# Altium project APP_1_huom2704.PrjPcb (part 2 of 3)

## Sheet APP_1_Connectors_m.SchDoc
size Tabloid; SheetNumber: 4; SheetTotal: 16; Sheet_Name: Connectors_m; Size: 11x17
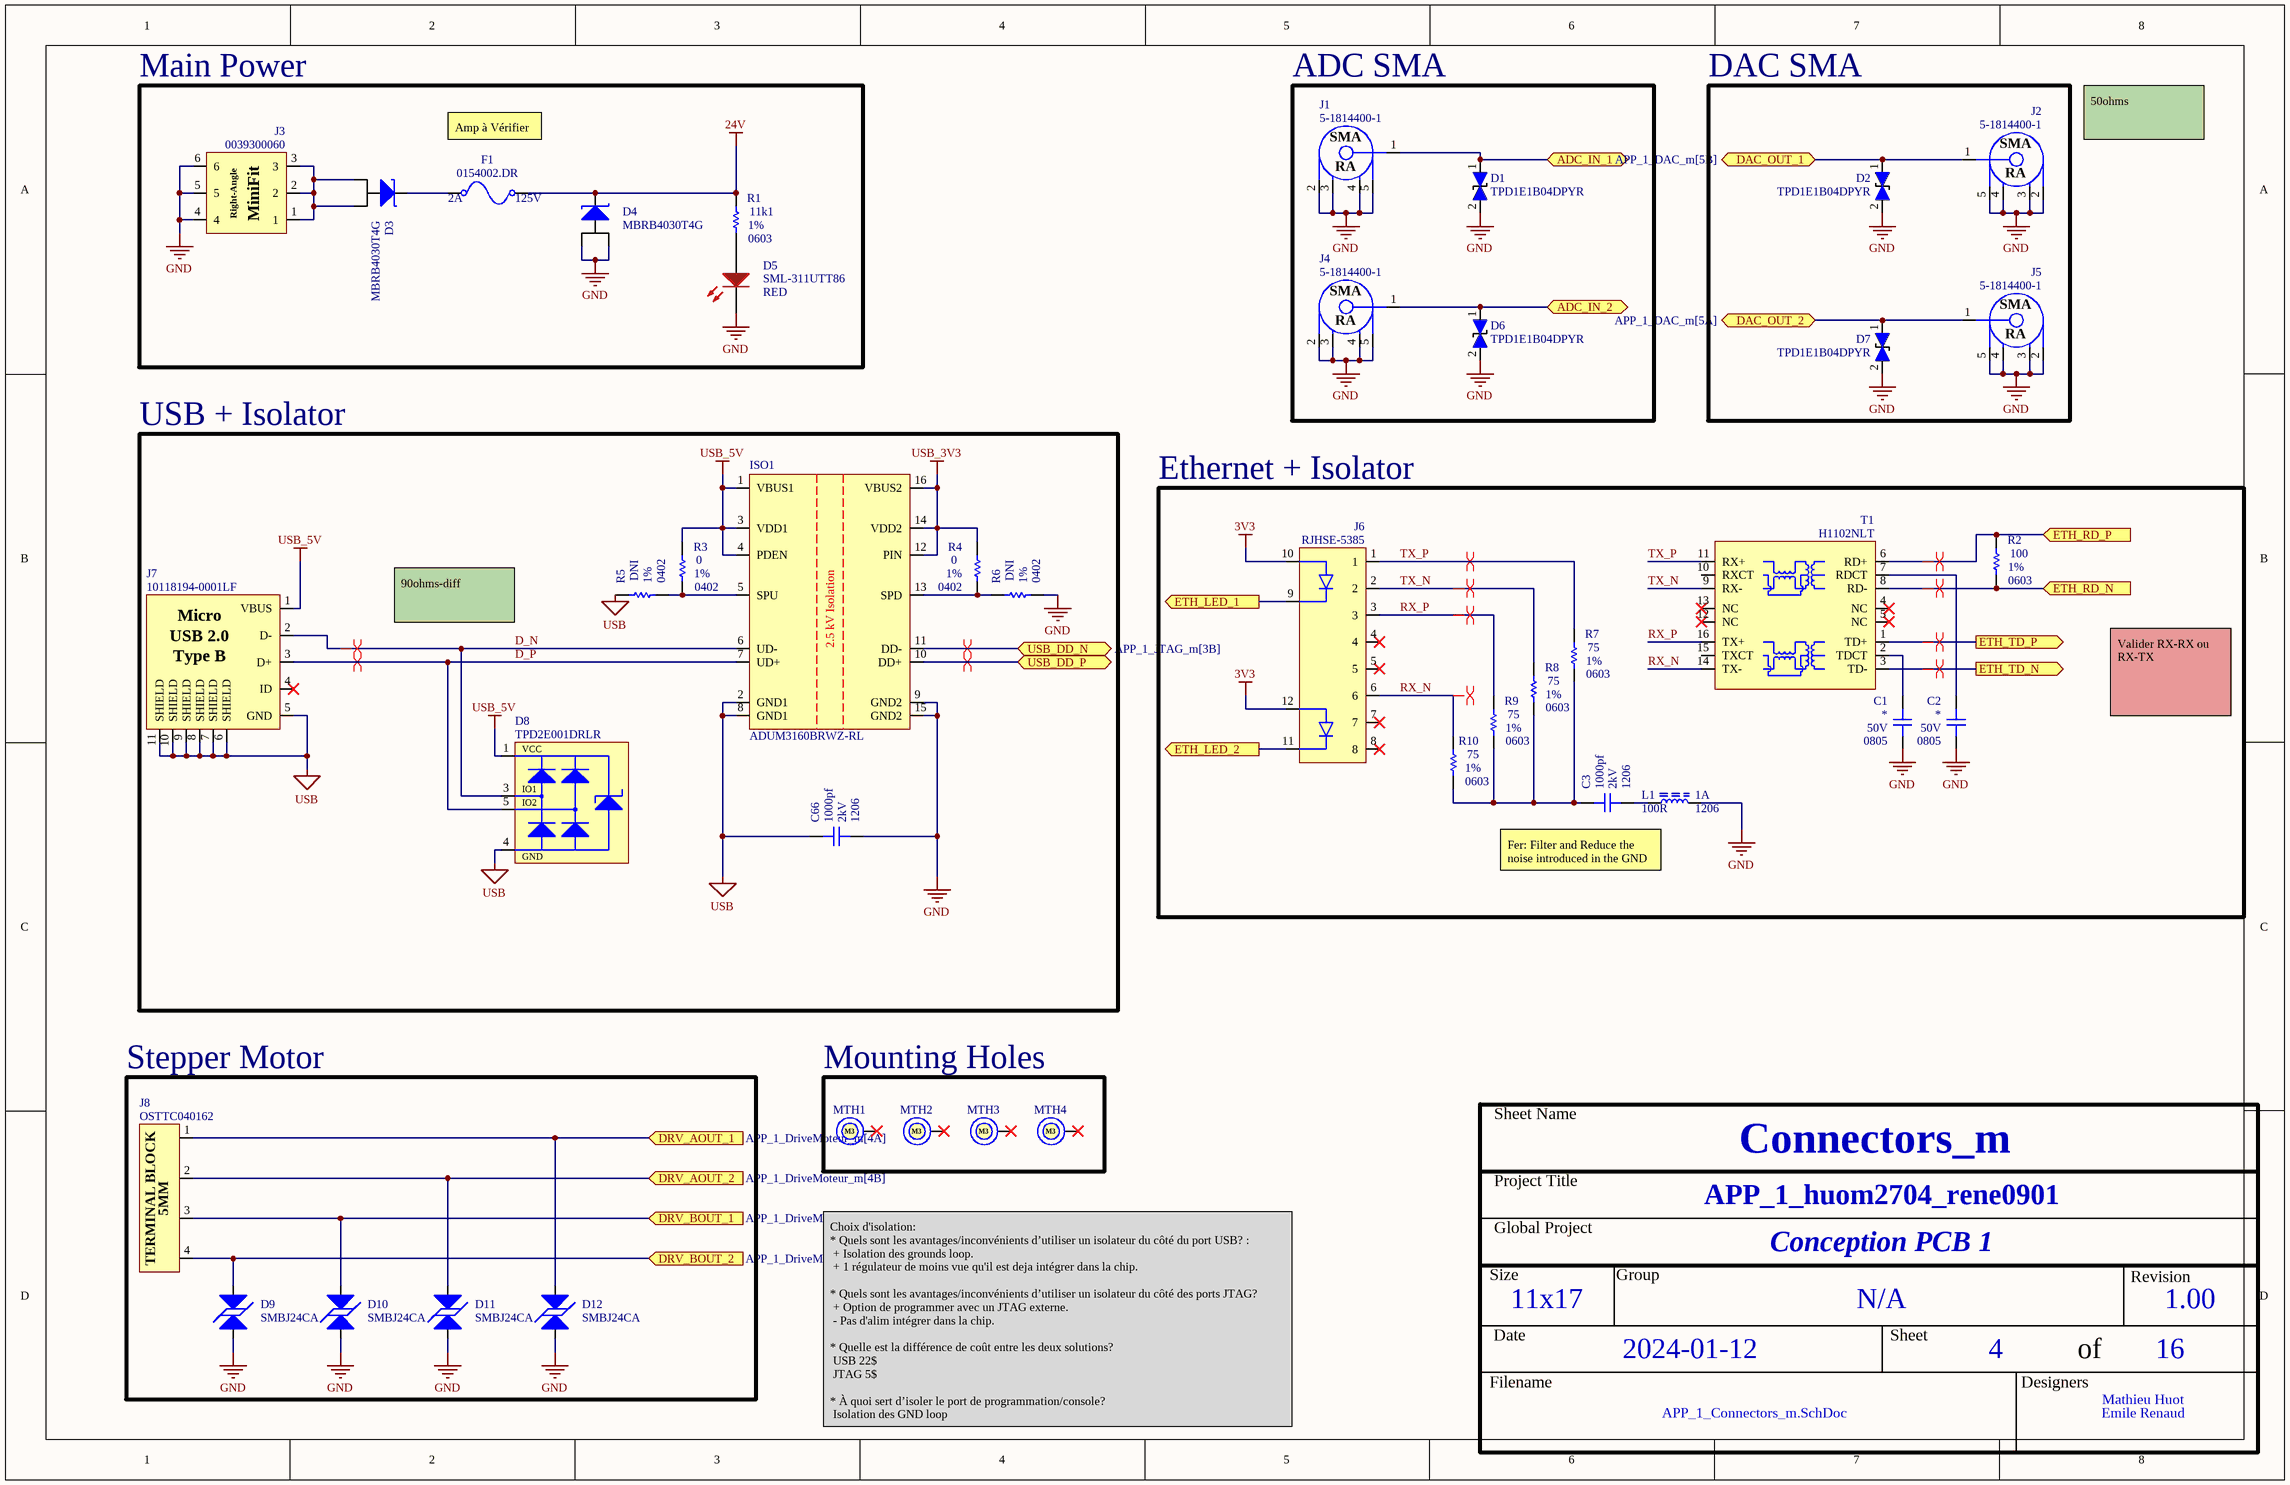
[diagram p6: APP_1_Connectors_m.SchDoc]

### Parts
(Parts that share a designator on the sheet are numbered #1, #2 ... from top to bottom, then left to right.)
C1  Voltage: 50V  Package: 0805  [CAP_0805]  (hidden comment: CAP - 0805)
C2  Voltage: 50V  Package: 0805  [CAP_0805]  (hidden comment: CAP - 0805)
C3  value 1000pf  Voltage: 2kV  Package: 1206  [CAP_1206]  (hidden comment: CAP - 1206)
C66#2  value 1000pf  Voltage: 2kV  Package: 1206  [CAP_1206]  (hidden comment: CAP - 1206)
D1  TPD1E1B04DPYR  [TVS_DATA_TPD1E1B04DPYR]
D2  TPD1E1B04DPYR  [TVS_DATA_TPD1E1B04DPYR]
D3  MBRB4030T4G  [DIO_SCHOTTKY_MBRB4030T4G]
D4  MBRB4030T4G  [DIO_SCHOTTKY_MBRB4030T4G]
D5  SML-311UTT86  value RED  [LED_0603]
D6  TPD1E1B04DPYR  [TVS_DATA_TPD1E1B04DPYR]
D7  TPD1E1B04DPYR  [TVS_DATA_TPD1E1B04DPYR]
D8  TPD2E001DRLR  [TVS_USB_TPD2E001DRLR]
D9  SMBJ24CA  [TVS_PWR_SMBJ36CA]
D10  SMBJ24CA  [TVS_PWR_SMBJ36CA]
D11  SMBJ24CA  [TVS_PWR_SMBJ36CA]
D12  SMBJ24CA  [TVS_PWR_SMBJ36CA]
F1  0154002.DR  Voltage Rating: 125V  Current Rating: 2A  [FUS_0154XXX.DR]
ISO1  ADUM3160BRWZ-RL  [ISO_ADUM3160BRWZ-RL]
J1  5-1814400-1  [CONN_SMA_5-1814400-1]
J2  5-1814400-1  [CONN_SMA_5-1814400-1]
J3  0039300060  [CON_MINIFIT_0039300060]
J4  5-1814400-1  [CONN_SMA_5-1814400-1]
J5  5-1814400-1  [CONN_SMA_5-1814400-1]
J6  RJHSE-5385  [CONN_ETHERNET_RJHSE-5385]
J7  10118194-0001LF  [CON_USB_10118194-0001LF]
J8  OSTTC040162  [CONN_TERMINAL_OSTTA040161]
L1  value 100R  Current: 1A  Package: 1206  [FER_1206]  (hidden comment: FER - 1206)
MTH1  M3  [MTH_M3]  (no BOM)
MTH2  M3  [MTH_M3]  (no BOM)
MTH3  M3  [MTH_M3]  (no BOM)
MTH4  M3  [MTH_M3]  (no BOM)
R1  value 11k1  Package: 0603  Precision: 1%  [RES_0603]  (hidden comment: RES - 0603)
R2  value 100  Package: 0603  Precision: 1%  [RES_0603]  (hidden comment: RES - 0603)
R3  value 0  Package: 0402  Precision: 1%  [RES_0402]  (hidden comment: RES - 0402)
R4  value 0  Package: 0402  Precision: 1%  [RES_0402]  (hidden comment: RES - 0402)
R5  value DNI  Package: 0402  Precision: 1%  [RES_0402]  (hidden comment: RES - 0402)
R6  value DNI  Package: 0402  Precision: 1%  [RES_0402]  (hidden comment: RES - 0402)
R7  value 75  Package: 0603  Precision: 1%  [RES_0603]  (hidden comment: RES - 0603)
R8  value 75  Package: 0603  Precision: 1%  [RES_0603]  (hidden comment: RES - 0603)
R9  value 75  Package: 0603  Precision: 1%  [RES_0603]  (hidden comment: RES - 0603)
R10  value 75  Package: 0603  Precision: 1%  [RES_0603]  (hidden comment: RES - 0603)
T1  H1102NLT  [TRANSFO_H1102NLT]

### Blocks framed on the sheet
Main Power: D3-D5 F1 J3 R1
ADC SMA: D1 D6 J1 J4
DAC SMA: D2 D7 J2 J5
USB + Isolator: C66#2 D8 ISO1 J7 R3-R6
Ethernet + Isolator: C1-C3 J6 L1 R2 R7-R10 T1
Stepper Motor: D9-D12 J8
Mounting Holes: MTH1-MTH4

### Ports
ADC_IN_1 (bidir, see APP_1_ADC_m[1B]), ADC_IN_2 (bidir, see APP_1_ADC_m[1A]), DAC_OUT_1 (bidir, see APP_1_DAC_m[5B]), DAC_OUT_2 (bidir, see APP_1_DAC_m[5A]), DRV_AOUT_1 (in, see APP_1_DriveMoteur_m[4A]), DRV_AOUT_2 (in, see APP_1_DriveMoteur_m[4B]), DRV_BOUT_1 (in, see APP_1_DriveMoteur_m[4B]), DRV_BOUT_2 (in, see APP_1_DriveMoteur_m[4C]), ETH_LED_1 (out), ETH_LED_2 (out), ETH_RD_N (in, see APP_1_Ethernet_m[3B]), ETH_RD_P (in, see APP_1_Ethernet_m[3B]), ETH_TD_N (out, see APP_1_Ethernet_m[3B]), ETH_TD_P (out, see APP_1_Ethernet_m[3B]), USB_DD_N (bidir, see APP_1_JTAG_m[3B]), USB_DD_P (bidir, see APP_1_JTAG_m[3B])

### Nets
3V3: J6.10(LED1_A) J6.12(LED2_A)
24V: D4.4 F1.2 R1.2
GND: C1.1 C2.1 C66#2.1 D1.2(i/o) D2.2(i/o) D4.1(A) D4.3 D5.K D6.2(i/o) D7.2(i/o) D9.2 D10.2 D11.2 D12.2 ISO1.9(GND2) ISO1.15(GND2) J1.2 J1.3 J1.4 J1.5 J2.2 J2.3 J2.4 J2.5 J3.4 J3.5 J3.6 J4.2 J4.3 J4.4 J4.5 J5.2 J5.3 J5.4 J5.5 L1.1 R6.1
USB: C66#2.2 D8.4(GND) ISO1.2(GND1) ISO1.8(GND1) J7.5(GND) J7.6(SHIELD) J7.7(SHIELD) J7.8(SHIELD) J7.9(SHIELD) J7.10(SHIELD) J7.11(SHIELD) R5.2
USB_3V3: ISO1.12(PIN) ISO1.14(VDD2) ISO1.16(VBUS2) R4.2
USB_5V: D8.1(VCC) ISO1.1(VBUS1) ISO1.3(VDD1) ISO1.4(PDEN) J7.1(VBUS) R3.2
ADC_IN_1: D1.1(i/o) J1.1 ; port ADC_IN_1
ADC_IN_2: D6.1(i/o) J4.1 ; port ADC_IN_2
D_N: D8.3(IO1) ISO1.6(UD-) J7.2(D-)
D_P: D8.5(IO2) ISO1.7(UD+) J7.3(D+)
DAC_OUT_1: D2.1(i/o) J2.1 ; port DAC_OUT_1
DAC_OUT_2: D7.1(i/o) J5.1 ; port DAC_OUT_2
DRV_AOUT_1: D12.1 J8.1 ; port DRV_AOUT_1
DRV_AOUT_2: D11.1 J8.2 ; port DRV_AOUT_2
DRV_BOUT_1: D10.1 J8.3 ; port DRV_BOUT_1
DRV_BOUT_2: D9.1 J8.4 ; port DRV_BOUT_2
ETH_LED_1: J6.9(LED1_K) ; port ETH_LED_1
ETH_LED_2: J6.11(LED2_K) ; port ETH_LED_2
ETH_RD_N: R2.1 T1.8(RD-) ; port ETH_RD_N
ETH_RD_P: R2.2 T1.6(RD+) ; port ETH_RD_P
ETH_TD_N: T1.3(TD-) ; port ETH_TD_N
ETH_TD_P: T1.1(TD+) ; port ETH_TD_P
RX_N: J6.6 R10.2 T1.14(TX-)
RX_P: J6.3 R9.2 T1.16(TX+)
TX_N: J6.2 R8.2 T1.9(RX-)
TX_P: J6.1 R7.2 T1.11(RX+)
USB_DD_N: ISO1.11(DD-) ; port USB_DD_N
USB_DD_P: ISO1.10(DD+) ; port USB_DD_P
NetC1_2: C1.2 T1.2(TDCT)
NetC2_2: C2.2 T1.7(RDCT)
NetC3_1: C3.1 L1.2
NetC3_2: C3.2 R7.1 R8.1 R9.1 R10.1
NetD3_1: D3.1(A) D3.3 J3.1 J3.2 J3.3
NetD3_4: D3.4 F1.1
NetD5_A: D5.A R1.1
NetISO1_5: ISO1.5(SPU) R3.1 R5.1
NetISO1_13: ISO1.13(SPD) R4.1 R6.2

Not connected (* = marked no-connect by the designer): D8 2(NC); J6 4* 5* 7* 8*; J7 4(ID)*; MTH1 1*; MTH2 1*; MTH3 1*; MTH4 1*; T1 4(NC)* 5(NC)* 10(RXCT) 12(NC)* 13(NC)* 15(TXCT)

### Layout directives
differential pair: USB_DD_N, USB_DD_P
differential pair; differential pair class ETH: ETH_RD_N, ETH_RD_P, ETH_TD_N, ETH_TD_P, RX_N, RX_P, TX_N, TX_P
differential pair; differential pair class USB: D_N, D_P

### Notes on the sheet
- Amp à Vérifier
- (near J2) 50ohms
- 90ohms-diff
- Valider RX-RX ou RX-TX
- Fer: Filter and Reduce the noise introduced in the GND
- Choix d'isolation:
  * Quels sont les avantages/inconvénients d’utiliser un isolateur du côté du port USB? :
  + Isolation des grounds loop.
  + 1 régulateur de moins vue qu'il est deja intégrer dans la chip.
  * Quels sont les avantages/inconvénients d’utiliser un isolateur du côté des ports JTAG?
  + Option de programmer avec un JTAG externe.
  - Pas d'alim intégrer dans la chip.
  * Quelle est la différence de coût entre les deux solutions?
  USB 22$
  JTAG 5$
  * À quoi sert d’isoler le port de programmation/console?
  Isolation des GND loop
- Sheet Name
- Project Title
- Global Project
- Size
- Group
- Revision
- Date
- Sheet
- of
- Filename
- Designers
- (in symbol CON_MINIFIT_0039300060) Right-Angle; MiniFit
- (in symbol CON_USB_10118194-0001LF) Micro; USB 2.0; Type B
- (in symbol CONN_SMA_5-1814400-1) SMA; RA
- (in symbol CONN_TERMINAL_OSTTC040162) TERMINAL BLOCK; 5MM
- (in symbol ISO_ADUM3160BRWZ-RL) 2.5 kV Isolation

### Library data of the parts
C1 C2 = CAP - 0805: Precision: 10%; Current: *; CreatedBy: Jonathan Bouchard; Power: *; Value: *
C3 C66#2 = CAP - 1206: Precision: 10%; Current: *; CreatedBy: Jonathan Bouchard; Power: *
D1 D2 D6 D7 = TVS_DATA_TPD1E1B04DPYR: TVS - TVS DIODE 3.6V 8.5V - 0402; Manufacturer #1: Texas Instruments; Current Rating: 6.3Apeak; Power Max: 50Wpeak; GRAMS Lib Spec: 2.8; Magnetic Material: Unknown; Polarized: No; Value: *; Tolerance: *; Voltage Rating: 3.6V; HelpURL: http://www.ti.com/lit/ds/symlink/tpd1e1b04.pdf; CreatedBy/Date: Keven Deslandes - 2018/10/19; VerifiedBy: Caroline Paulin - 28 janv 2019; Temperature: -40°C ~ 125°C (TA); Package: 0402; Manufacturer #2: *; Note: *; Assembly Type: SMD; Part Number #2: *; Part Number #1: TPD1E1B04DPYR; Supplier 1: Digi-Key; Supplier Part Number 1: 296-47364-1-ND; Cryo: UNKNOWN
D3 D4 = DIO_SCHOTTKY_MBRB4030T4G: DIO - 30V MAX 40 A - TO-263-3; Manufacturer #1: ON Semiconductor; Value: Vf = 550mV @ 40A; Current Rating: 40A; GRAMS Lib Spec: 2.8; Magnetic Material: NO; Polarized: Yes; Cryo: UNKNOWN; Tolerance: *; Voltage Rating: 30V; Power Max: *; HelpURL: http://www.onsemi.com/pub/Collateral/MBRB4030-D.PDF; CreatedBy/Date: Arnaud Samson - 06/07/18; VerifiedBy: Jonathan Bouchard 2018-07-12; Temperature: -65°C ~ 175°C; Package: D2PAK; Manufacturer #2: *; Note: *; Assembly Type: SMD; Part Number #2: *; Part Number #1: MBRB4030T4G; Supplier 1: Digi-Key; Supplier Part Number 1: MBRB4030T4GOSCT-ND
D5 = LED_SML-311UTT86: LED - 620nM RED 2mA - 0603; Voltage: 1.8V; Mfg: ROHM Semiconductor; Power: 44mW; Current: 2mA; HelpURL: http://media.digikey.com/pdf/Data%20Sheets/Rohm%20PDFs/SML-311%20Series.pdf; CreatedBy: Jonathan Bouchard; Temperature: -30°C to 85°C; Package: 0603; Precision: *; Mfg Part Number: SML-311UTT86; Supplier 1: Digikey; Supplier Part Number 1: 511-1304-1-ND
D8 = TVS_USB_TPD2E001DRLR: TVS - USB TVS DIODE 5.5V - SOT-553; Manufacturer #1: Texas Instruments; Value: 11V Breakdown; Voltage Rating: 5.5V (Max); GRAMS Lib Spec: 2.8; Magnetic Material: YES; Cryo: UNKNOWN; Tolerance: *; Current Rating: *; Power Max: *; HelpURL: http://www.ti.com/lit/ds/symlink/tpd2e001.pdf; CreatedBy/Date: Jonathan Bouchard 2018-07-10; VerifiedBy: Arnaud Samson 16-07-18; Temperature: -40°C ~ 85°C (TA); Package: SOT-553; Manufacturer #2: *; Note: *; Assembly Type: SMD; Part Number #2: *; Part Number #1: TPD2E001DRLR; Polarized: YES; Supplier 1: Digi-Key; Supplier Part Number 1: 296-21883-1-ND
D9-D12 = TVS_PWR_SMBJ24CA: TVS - 24V 26.7V 600W - DO214AA; Manufacturer #1: Littelfuse Inc.; Value: Vbr = 26.7V -  Clamp = 38.9V; Voltage Rating: 24V Standoff; Current Rating: 15.5A; GRAMS Lib Spec: 2.8; Magnetic Material: UNKNOWN; Polarized: NO; Tolerance: *; Power Max: 600W; HelpURL: http://www.littelfuse.com/~/media/electronics/datasheets/tvs_diodes/littelfuse_tvs_diode_smbj_datasheet.pdf.pdf; CreatedBy/Date: Arnaud Samson - 06/07/18; VerifiedBy: Jonathan Bouchard - 2018-07-13; Temperature: -65°C ~ 150°C (TJ); Package: DO214AA; Manufacturer #2: *; Note: *; Assembly Type: SMD; Part Number #2: *; Part Number #1: SMBJ24CA; Supplier 1: Digi-Key; Supplier Part Number 1: SMBJ24CALFCT-ND; Cryo: UNKNOWN
F1 = FUS_0154002.DR: FUS - 2 A 125 VAC/VDC - 2-SMD; Manufacturer #1: Littelfuse Inc.; Value: 2A 125V AC/DC FAST; GRAMS Lib Spec: 2.8; Magnetic Material: UNKNOWN; Polarized: NO; Tolerance: *; Power Max: *; HelpURL: http://www.littelfuse.com/~/media/electronics/datasheets/fuses/littelfuse_fuse_154_154t_154l_154tl_datasheet.pdf.pdf; CreatedBy/Date: Jonathan Bouchard 2018-07-17; VerifiedBy: Arnaud Samson 23-07-18; Temperature: -55°C ~ 125°C; Package: 2-SMD; Manufacturer #2: *; Note: *; Assembly Type: SMD; Part Number #2: *; Part Number #1: 0154002.DR; Supplier 1: Digi-Key; Supplier Part Number 1: F1224CT-ND; Cryo: UNKNOWN
ISO1 = ISO_ADUM3160BRWZ-RL: ISO - DGTL ISO 2.5KV 2CH USB - 16SOIC; Manufacturer #1: Analog Devices; Value: 2500Vrms voltage isolation; Voltage Rating: 3~5.5V; GRAMS Lib Spec: 2.8; Magnetic Material: UNKNOWN; Polarized: Yes; Tolerance: *; Current Rating: *; Power Max: *; HelpURL: https://www.analog.com/media/en/technical-documentation/data-sheets/ADuM3160.pdf; CreatedBy/Date: Tommy Rossignol 2018-11-16; VerifiedBy: Caroline Paulin - 13 février 2019; Temperature: -40°C ~ 105°C; Package: 16-SOIC; Manufacturer #2: *; Assembly Type: SMD; Part Number #2: *; Part Number #1: ADUM3160BRWZ-RL; Supplier 1: Digi-Key; Supplier Part Number 1: ADUM3160BRWZ-RLCT-ND; Cryo: UNKNOWN
J1 J2 J4 J5 = CONN_SMA_5-1814400-1: CONN -  SMA JACK R/A 50 OHM - TH; Mfg: TE Connectivity AMP Connectors; Voltage: *; Current: *; Power: *; Mfg Part Number: 5-1814400-1; HelpURL: http://www.te.com/commerce/DocumentDelivery/DDEController?Action=srchrtrv&DocNm=1814400&DocType=Customer+Drawing&DocLang=English; CreatedBy: Jonathan Bouchard; Temperature: -55°C ~ 85°C; Value: *; Precision: *; Package: TH-5; Supplier 1: Digikey; Supplier Part Number 1: A97593-ND
J3 = CON_MINIFIT_0039300060: CON - Mini-Fit Through Hole, Right Angle 6 position; Manufacturer #1: Molex; Current Rating: 8A; GRAMS Lib Spec: 2.8; Magnetic Material: Unknown; Polarized: Yes; Voltage Rating: 600V; Assembly Type: TH; CreatedBy/Date: Joel Lemay 2018-06-21; HelpURL: https://www.molex.com/pdm_docs/sd/039300060_sd.pdf; Manufacturer #2: *; Package: TH; Part Number #1: 0039300060; Part Number #2: *; Power Max: *; Supplier 1: Digi-Key; Supplier Part Number 1: WM21353-ND; Temperature: - 40°C to + 80°C; Tolerance: *; Value: *; VerifiedBy: Caroline Paulin - 10 sept 2018; Cryo: UNKNOWN
J6 = CONN_ETHERNET_RJHSE-5385: CONN - MOD JACK RJ45 R/A ETHERNET - TH; Mfg: Amphenol; Voltage: *; Current: *; Power: *; Mfg Part Number: RJHSE-5385; HelpURL: https://www.amphenolcanada.com/ProductSearch/drawings/AC/RJHSE538X.pdf; CreatedBy: Jonathan Bouchard; Temperature: -55°C ~ 85°C; Value: *; Precision: *; Package: TH-12; Supplier 1: Digikey; Supplier Part Number 1: RJHSE-5385-ND
J7 = CON_USB_10118194-0001LF: CON - USB MICRO B RECPT SMT R/A - 4PIN; Manufacturer #1: Amphenol FCI; Value: USB - Micro B; Voltage Rating: 100VAC; Current Rating: 1.8A; GRAMS Lib Spec: 2.8; Magnetic Material: YES; Cryo: UNKNOWN; Tolerance: *; Power Max: *; HelpURL: https://cdn.amphenol-icc.com/media/wysiwyg/files/drawing/10118194.pdf; CreatedBy/Date: Arnaud Samson - 09/07/18; VerifiedBy: Jonathan Bouchard 2018-07-12; Temperature: -30°C ~ 80°C; Package: 5-SMD; Manufacturer #2: *; Note: *; Assembly Type: SMD; Part Number #2: *; Part Number #1: 10118194-0001LF; Polarized: YES; Supplier 1: Digi-Key; Supplier Part Number 1: 609-4618-1-ND
J8 = CONN_TERMINAL_OSTTC040162: CONN -  TERMINAL BLOCK 4POS 5MM - TH; Mfg: On Shore Technology Inc.; Voltage: *; Current: *; Power: *; Mfg Part Number: OSTTC040162; HelpURL: http://www.on-shore.com/wp-content/uploads/2015/09/osttcxx0162.pdf; CreatedBy: Jonathan Bouchard; Temperature: -30°C ~ 105°C; Value: *; Precision: *; Package: TH-4; Supplier 1: Digikey; Supplier Part Number 1: ED2602-ND
MTH1-MTH4 = MTH_M3: MTH - MOUNTING HOLE M3 PLATED - M3; GRAMS Lib Spec: 2.8; Magnetic Material: NO; Cryo: UNKNOWN; Value: *; Tolerance: *; Voltage Rating: *; Current Rating: *; Power Max: *; HelpURL: https://littlemachineshop.com/images/gallery/PDF/TapDrillSizes.pdf; CreatedBy/Date: Jonathan Bouchard 2018-07-23; VerifiedBy: Arnaud Samson 23-07-18; Temperature: *; Package: M3; Manufacturer #1: *; Manufacturer #2: *; Note: *; Assembly Type: NONE; Part Number #2: *; Part Number #1: *; Polarized: *; Supplier 1: *; Supplier Part Number 1: *
R3 R4 = RES - 0402: Voltage: 50V; Current: DNI; Power: 1/16W; CreatedBy: Jonathan Bouchard
R5 R6 = RES - 0402: Voltage: 50V; Power: 1/16W; Current: DNI; CreatedBy: Jonathan Bouchard
T1 = TRANSFO_H1102NLT: TRANSFO - ETHERNET 10/100B-TX - SMD-16; Mfg: Pulse Eng.; Value: 1:1 (350uH); Voltage: *; Current: *; Power: *; Mfg Part Number: H1102NLT; HelpURL: http://media.digikey.com/pdf/Data%20Sheets/Pulse%20PDFs/10_100BASE-T%20Single%20Port%20SMD%20Magnetics_Rev2008.pdf; CreatedBy: Jonathan Bouchard; Temperature: -40°C to 85°C; Precision: *; Package: SMD-16; Supplier 1: Digikey; Supplier Part Number 1: 553-1532-1-ND
L1 = FER - 1206: Voltage: *; CreatedBy: Jonathan Bouchard; Power: *; Precision: *
R1 R2 R7-R10 = RES - 0603: Current: *; CreatedBy: Jonathan Bouchard

## Sheet APP_1_DriveMoteur_m.SchDoc
size Tabloid; SheetNumber: 8; SheetTotal: 15; Sheet_Name: DriveMoteur; Size: 11x17
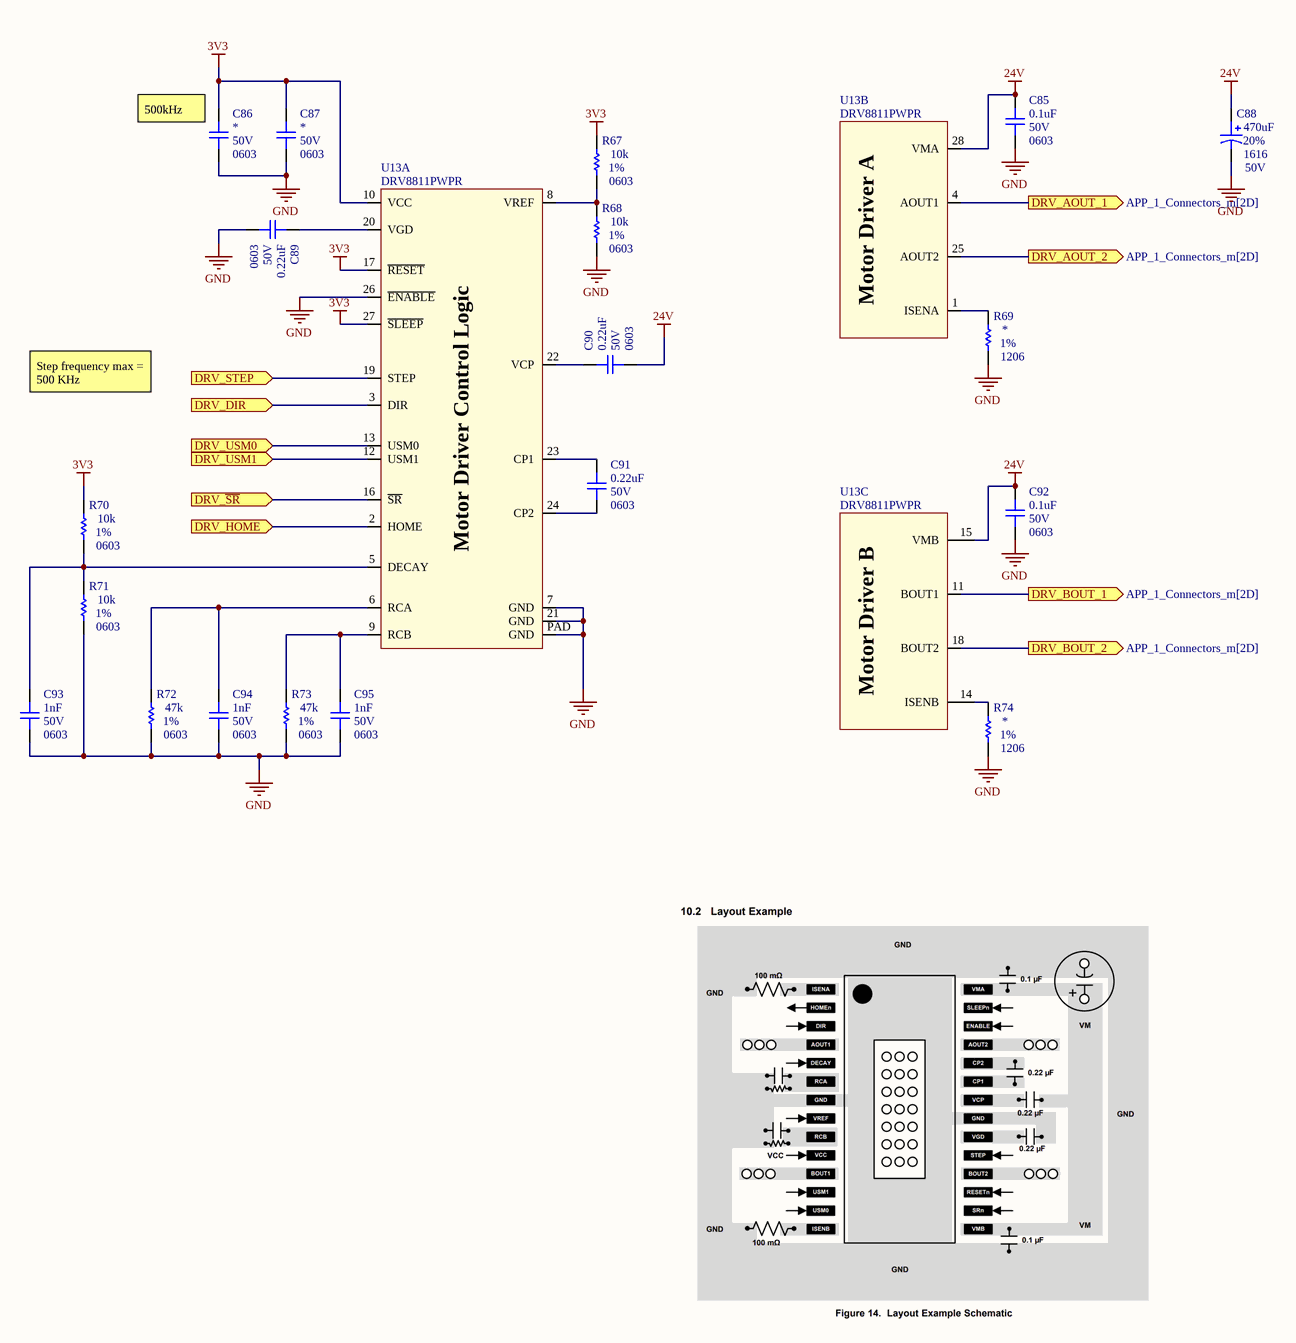
[diagram p7: APP_1_DriveMoteur_m.SchDoc]

### Parts
C85  value 0.1uF  Voltage: 50V  Package: 0603  [CAP_0603]  (hidden comment: CAP - 0603)
C86  Voltage: 50V  Package: 0603  [CAP_0603]  (hidden comment: CAP - 0603)
C87  Voltage: 50V  Package: 0603  [CAP_0603]  (hidden comment: CAP - 0603)
C88  value 470uF  Voltage: 50V  Package: 1616  Precision: 20%  [CAP_ALU_1616_vishay]  (hidden comment: MAL214699108E3)
C89  value 0.22uF  Voltage: 50V  Package: 0603  [CAP_0603]  (hidden comment: CAP - 0603)
C90  value 0.22uF  Voltage: 50V  Package: 0603  [CAP_0603]  (hidden comment: CAP - 0603)
C91  value 0.22uF  Voltage: 50V  Package: 0603  [CAP_0603]  (hidden comment: CAP - 0603)
C92  value 0.1uF  Voltage: 50V  Package: 0603  [CAP_0603]  (hidden comment: CAP - 0603)
C93  value 1nF  Voltage: 50V  Package: 0603  [CAP_0603]  (hidden comment: CAP - 0603)
C94  value 1nF  Voltage: 50V  Package: 0603  [CAP_0603]  (hidden comment: CAP - 0603)
C95  value 1nF  Voltage: 50V  Package: 0603  [CAP_0603]  (hidden comment: CAP - 0603)
R67  value 10k  Package: 0603  Precision: 1%  [RES_0603]  (hidden comment: RES - 0603)
R68  value 10k  Package: 0603  Precision: 1%  [RES_0603]  (hidden comment: RES - 0603)
R69  Package: 1206  Precision: 1%  [RES_1206]  (hidden comment: RES - 1206)
R70  value 10k  Package: 0603  Precision: 1%  [RES_0603]  (hidden comment: RES - 0603)
R71  value 10k  Package: 0603  Precision: 1%  [RES_0603]  (hidden comment: RES - 0603)
R72  value 47k  Package: 0603  Precision: 1%  [RES_0603]  (hidden comment: RES - 0603)
R73  value 47k  Package: 0603  Precision: 1%  [RES_0603]  (hidden comment: RES - 0603)
R74  Package: 1206  Precision: 1%  [RES_1206]  (hidden comment: RES - 1206)
U13  DRV8811PWPR  [POW_MOTOR_DRV8811PWPR]  (parts A,B,C of 3)

### Ports
DRV_AOUT_1 (out, see APP_1_Connectors_m[2D]), DRV_AOUT_2 (out, see APP_1_Connectors_m[2D]), DRV_BOUT_1 (out, see APP_1_Connectors_m[2D]), DRV_BOUT_2 (out, see APP_1_Connectors_m[2D]), DRV_DIR (in), DRV_HOME (in), DRV_STEP (in), DRV_USM0 (in), DRV_USM1 (in), DRV_~{SR} (in)

### Nets
3V3: C86.2 C87.2 R67.2 R70.2 U13.10(VCC) U13.17(~{RESET}) U13.27(~{SLEEP})
24V: C85.2 C88.1 C90.1 C92.2 U13.15(VMB) U13.28(VMA)
GND: C85.1 C86.1 C87.1 C88.2 C89.1 C92.1 C93.1 C94.1 C95.1 R68.1 R69.1 R71.1 R72.1 R73.1 R74.1 U13.7(GND) U13.21(GND) U13.26(~{ENABLE}) U13.PAD(GND)
DRV_AOUT_1: U13.4(AOUT1) ; port DRV_AOUT_1
DRV_AOUT_2: U13.25(AOUT2) ; port DRV_AOUT_2
DRV_BOUT_1: U13.11(BOUT1) ; port DRV_BOUT_1
DRV_BOUT_2: U13.18(BOUT2) ; port DRV_BOUT_2
DRV_DIR: U13.3(DIR) ; port DRV_DIR
DRV_HOME: U13.2(HOME) ; port DRV_HOME
DRV_~{SR}: U13.16(~{SR}) ; port DRV_~{SR}
DRV_STEP: U13.19(STEP) ; port DRV_STEP
DRV_USM0: U13.13(USM0) ; port DRV_USM0
DRV_USM1: U13.12(USM1) ; port DRV_USM1
NetC89_2: C89.2 U13.20(VGD)
NetC90_2: C90.2 U13.22(VCP)
NetC91_1: C91.1 U13.24(CP2)
NetC91_2: C91.2 U13.23(CP1)
NetC93_2: C93.2 R70.1 R71.2 U13.5(DECAY)
NetC94_2: C94.2 R72.2 U13.6(RCA)
NetC95_2: C95.2 R73.2 U13.9(RCB)
NetR67_1: R67.1 R68.2 U13.8(VREF)
NetR69_2: R69.2 U13.1(ISENA)
NetR74_2: R74.2 U13.14(ISENB)

### Notes on the sheet
- (near C86) 500kHz
- Step frequency max = 500 KHz
- Sheet Name
- Project Title
- Global Project
- Size
- Group
- Revision
- Date
- Sheet
- of
- Filename
- Designers
- (in symbol POW_MOTOR_DRV8811PWPR, part A) Motor Driver Control Logic
- (in symbol POW_MOTOR_DRV8811PWPR, part B) Motor Driver A
- (in symbol POW_MOTOR_DRV8811PWPR, part C) Motor Driver B

### Library data of the parts
C85-C87 C89-C95 = CAP - 0603: Precision: 10%; Current: *; CreatedBy: Jonathan Bouchard; Power: *
  C86 C87: Value: *
C88 = CAP_ALU_MAL214699108E3: CAP - ALU 470uF 20% 50V - 1616; Current: 1.3A; Mfg: Vishay Dale; Mfg Part Number: MAL214699108E3; HelpURL: http://www.vishay.com/docs/28403/146cti.pdf; CreatedBy: Jonathan Bouchard; Temperature: -55°C to 125°C; Power: *; Supplier 1: Digikey; Supplier Part Number 1: 4442PHCT-ND
U13 = POW_MOTOR_DRV8811PWPR: POW - STEPPER MOTOR DRIVER - SOP-28; Voltage: 3 V ~ 5.5 V / 8 V ~ 38 V; Mfg: Texas Instrument; Current: *; Power: *; Mfg Part Number: DRV8811PWPR; HelpURL: http://www.ti.com/lit/ds/symlink/drv8811.pdf; CreatedBy: Jonathan Bouchard; Temperature: -40°C ~ 150°C (TJ); Value: *; Precision: *; Package: SOP-28; Supplier 1: Digikey; Supplier Part Number 1: 296-24591-1-ND
R67 R68 R70-R73 = RES - 0603: Current: *; CreatedBy: Jonathan Bouchard
R69 R74 = RES - 1206: Current: *; CreatedBy: Jonathan Bouchard; Value: *

## Sheet APP_1_Power_m.SchDoc
size Tabloid; SheetNumber: 10; SheetTotal: 16; Sheet_Name: Power; Size: 11x17
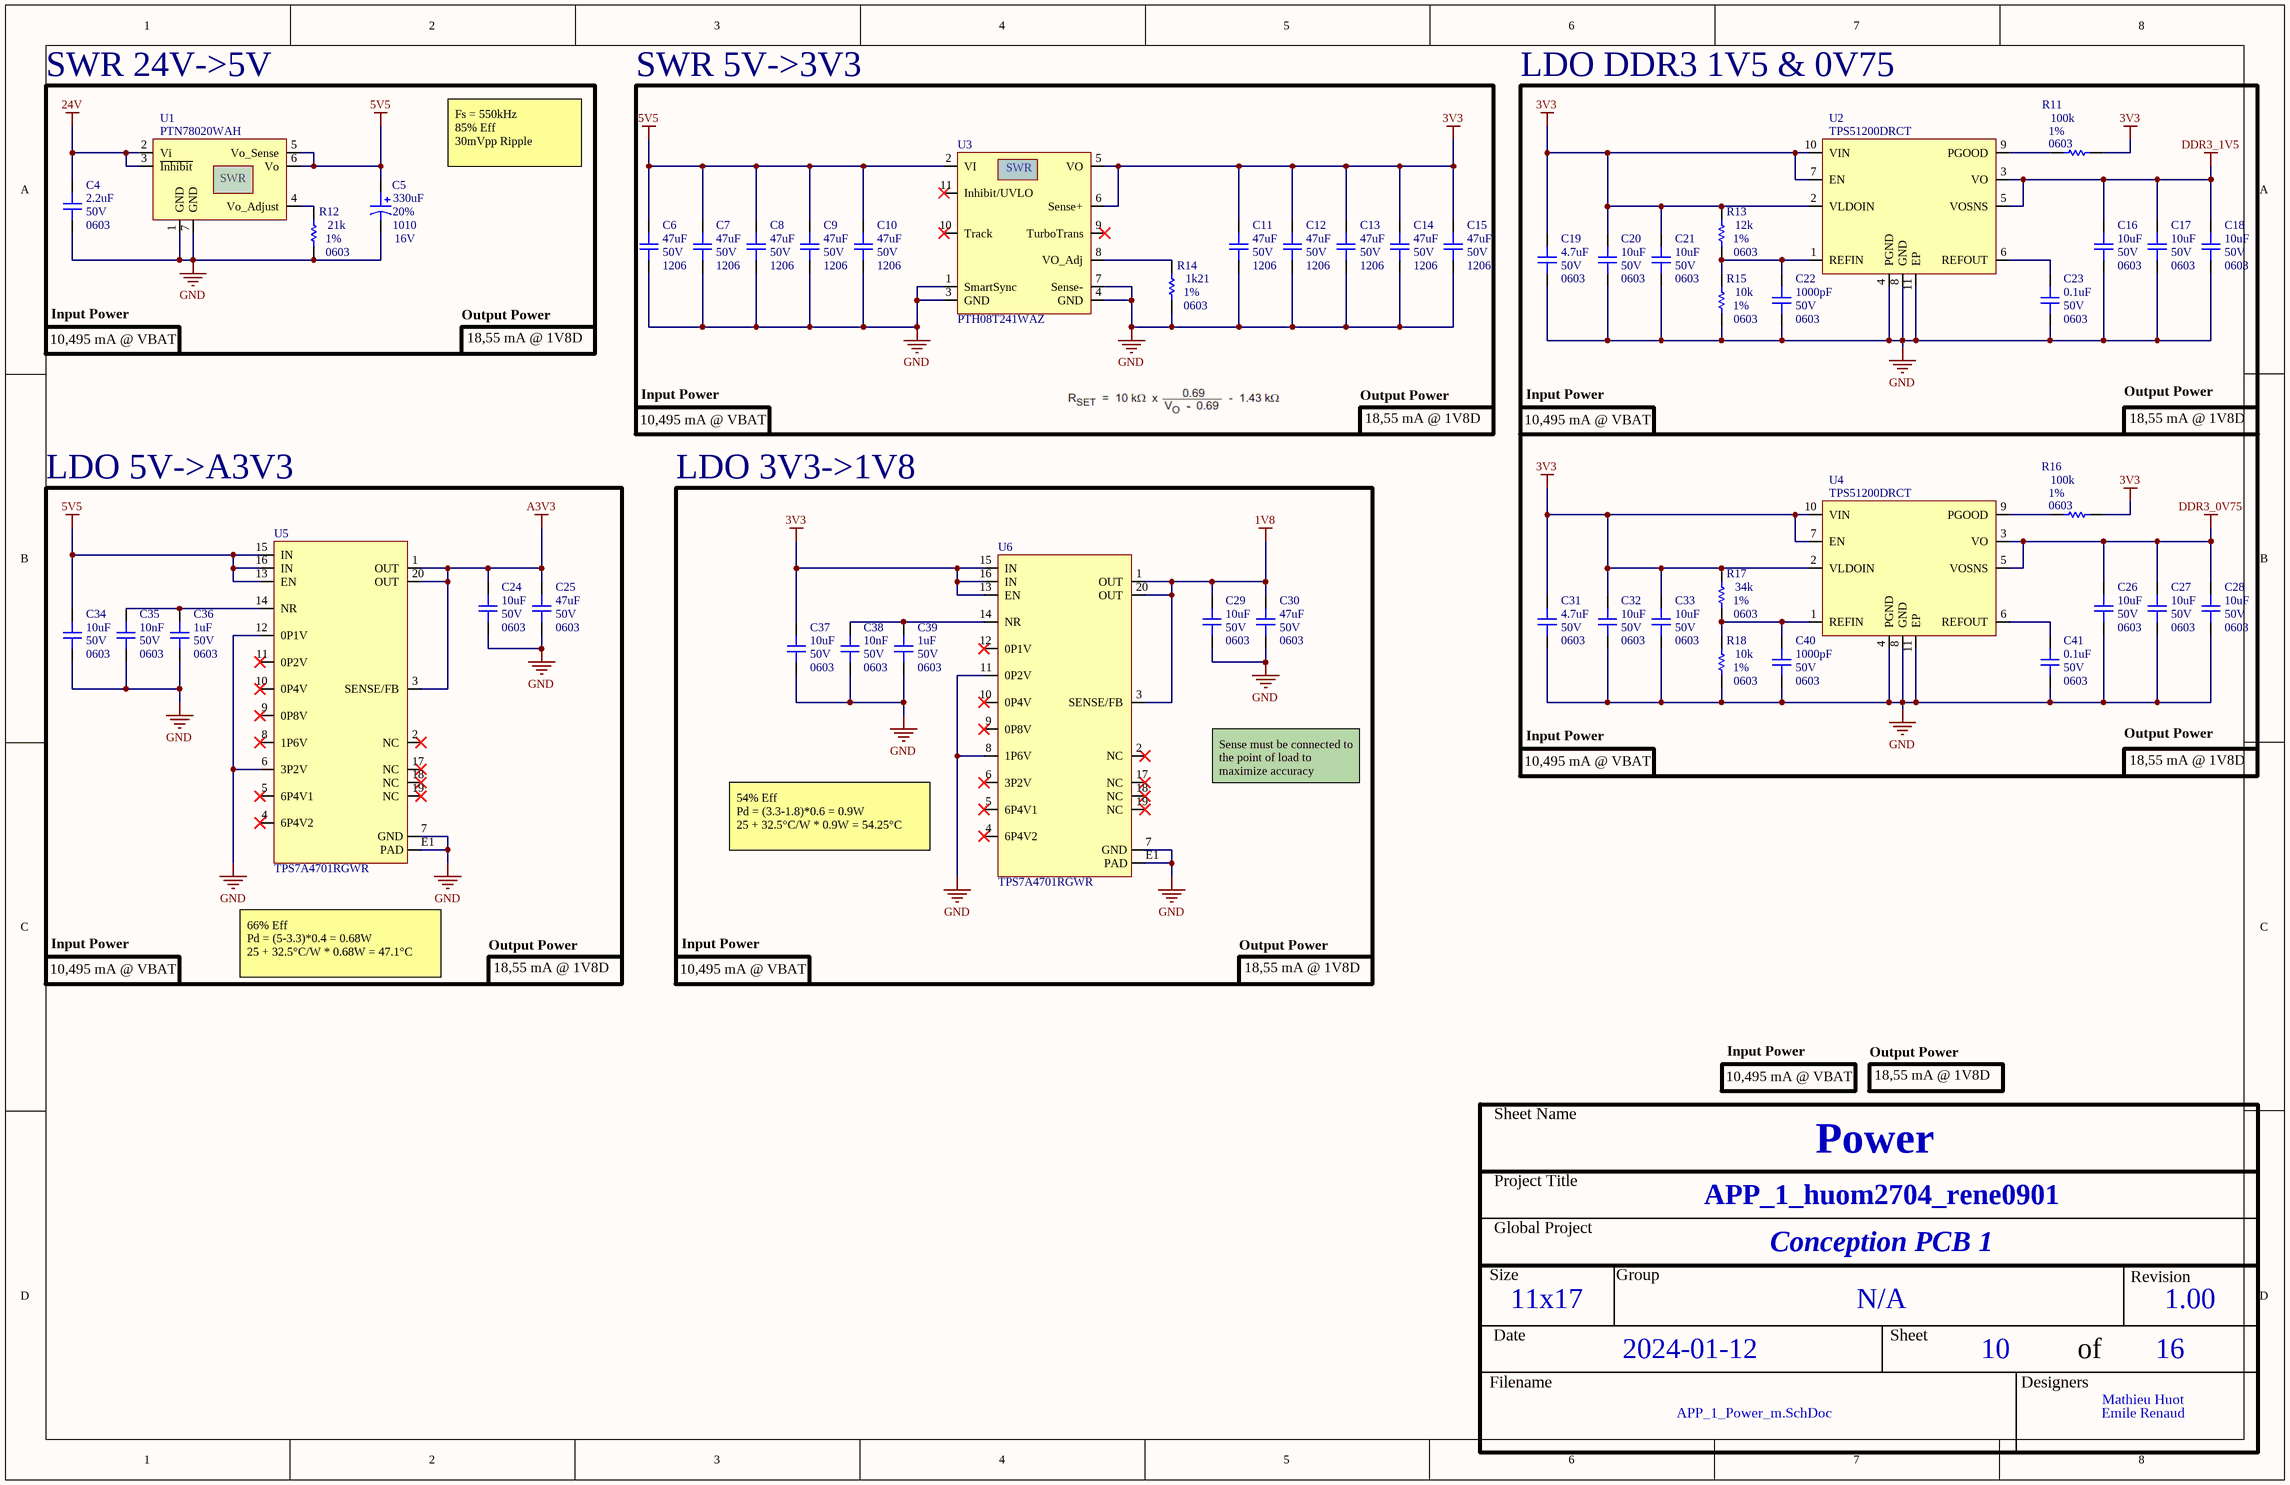
[diagram p8: APP_1_Power_m.SchDoc]

### Parts
C4  value 2.2uF  Voltage: 50V  Package: 0603  [CAP_0603]  (hidden comment: CAP - 0603)
C5  value 330uF  Voltage: 16V  Package: 1010  Precision: 20%  [CAP_ALU_1010_vishay]  (hidden comment: MAL214699501E3)
C6  value 47uF  Voltage: 50V  Package: 1206  [CAP_1206]  (hidden comment: CAP - 1206)
C7  value 47uF  Voltage: 50V  Package: 1206  [CAP_1206]  (hidden comment: CAP - 1206)
C8  value 47uF  Voltage: 50V  Package: 1206  [CAP_1206]  (hidden comment: CAP - 1206)
C9  value 47uF  Voltage: 50V  Package: 1206  [CAP_1206]  (hidden comment: CAP - 1206)
C10  value 47uF  Voltage: 50V  Package: 1206  [CAP_1206]  (hidden comment: CAP - 1206)
C11  value 47uF  Voltage: 50V  Package: 1206  [CAP_1206]  (hidden comment: CAP - 1206)
C12  value 47uF  Voltage: 50V  Package: 1206  [CAP_1206]  (hidden comment: CAP - 1206)
C13  value 47uF  Voltage: 50V  Package: 1206  [CAP_1206]  (hidden comment: CAP - 1206)
C14  value 47uF  Voltage: 50V  Package: 1206  [CAP_1206]  (hidden comment: CAP - 1206)
C15  value 47uF  Voltage: 50V  Package: 1206  [CAP_1206]  (hidden comment: CAP - 1206)
C16  value 10uF  Voltage: 50V  Package: 0603  [CAP_0603]  (hidden comment: CAP - 0603)
C17  value 10uF  Voltage: 50V  Package: 0603  [CAP_0603]  (hidden comment: CAP - 0603)
C18  value 10uF  Voltage: 50V  Package: 0603  [CAP_0603]  (hidden comment: CAP - 0603)
C19  value 4.7uF  Voltage: 50V  Package: 0603  [CAP_0603]  (hidden comment: CAP - 0603)
C20  value 10uF  Voltage: 50V  Package: 0603  [CAP_0603]  (hidden comment: CAP - 0603)
C21  value 10uF  Voltage: 50V  Package: 0603  [CAP_0603]  (hidden comment: CAP - 0603)
C22  value 1000pF  Voltage: 50V  Package: 0603  [CAP_0603]  (hidden comment: CAP - 0603)
C23  value 0.1uF  Voltage: 50V  Package: 0603  [CAP_0603]  (hidden comment: CAP - 0603)
C24  value 10uF  Voltage: 50V  Package: 0603  [CAP_0603]  (hidden comment: CAP - 0603)
C25  value 47uF  Voltage: 50V  Package: 0603  [CAP_0603]  (hidden comment: CAP - 0603)
C26  value 10uF  Voltage: 50V  Package: 0603  [CAP_0603]  (hidden comment: CAP - 0603)
C27  value 10uF  Voltage: 50V  Package: 0603  [CAP_0603]  (hidden comment: CAP - 0603)
C28  value 10uF  Voltage: 50V  Package: 0603  [CAP_0603]  (hidden comment: CAP - 0603)
C29  value 10uF  Voltage: 50V  Package: 0603  [CAP_0603]  (hidden comment: CAP - 0603)
C30  value 47uF  Voltage: 50V  Package: 0603  [CAP_0603]  (hidden comment: CAP - 0603)
C31  value 4.7uF  Voltage: 50V  Package: 0603  [CAP_0603]  (hidden comment: CAP - 0603)
C32  value 10uF  Voltage: 50V  Package: 0603  [CAP_0603]  (hidden comment: CAP - 0603)
C33  value 10uF  Voltage: 50V  Package: 0603  [CAP_0603]  (hidden comment: CAP - 0603)
C34  value 10uF  Voltage: 50V  Package: 0603  [CAP_0603]  (hidden comment: CAP - 0603)
C35  value 10nF  Voltage: 50V  Package: 0603  [CAP_0603]  (hidden comment: CAP - 0603)
C36  value 1uF  Voltage: 50V  Package: 0603  [CAP_0603]  (hidden comment: CAP - 0603)
C37  value 10uF  Voltage: 50V  Package: 0603  [CAP_0603]  (hidden comment: CAP - 0603)
C38  value 10nF  Voltage: 50V  Package: 0603  [CAP_0603]  (hidden comment: CAP - 0603)
C39  value 1uF  Voltage: 50V  Package: 0603  [CAP_0603]  (hidden comment: CAP - 0603)
C40  value 1000pF  Voltage: 50V  Package: 0603  [CAP_0603]  (hidden comment: CAP - 0603)
C41  value 0.1uF  Voltage: 50V  Package: 0603  [CAP_0603]  (hidden comment: CAP - 0603)
R11  value 100k  Package: 0603  Precision: 1%  [RES_0603]  (hidden comment: RES - 0603)
R12  value 21k  Package: 0603  Precision: 1%  [RES_0603]  (hidden comment: RES - 0603)
R13  value 12k  Package: 0603  Precision: 1%  [RES_0603]  (hidden comment: RES - 0603)
R14  value 1k21  Package: 0603  Precision: 1%  [RES_0603]  (hidden comment: RES - 0603)
R15  value 10k  Package: 0603  Precision: 1%  [RES_0603]  (hidden comment: RES - 0603)
R16  value 100k  Package: 0603  Precision: 1%  [RES_0603]  (hidden comment: RES - 0603)
R17  value 34k  Package: 0603  Precision: 1%  [RES_0603]  (hidden comment: RES - 0603)
R18  value 10k  Package: 0603  Precision: 1%  [RES_0603]  (hidden comment: RES - 0603)
U1  PTN78020WAH  [REG_SWR_PTN78020WAH]
U2  TPS51200DRCT  [REG_PMIC_TPS51200DRCT]
U3  PTH08T241WAZ  [REG_SWR_PTH08T241WAZ]
U4  TPS51200DRCT  [REG_PMIC_TPS51200DRCT]
U5  TPS7A4701RGWR  [REG_TPS7A4701RGWR]
U6  TPS7A4701RGWR  [REG_TPS7A4701RGWR]

### Blocks framed on the sheet
SWR 24V->5V: C4 C5 R12 U1
SWR 5V->3V3: C6-C15 R14 U3
LDO DDR3 1V5 & 0V75: C16-C23 C26-C28 C31-C33 C40 C41 R11 R13 R15-R18 U2 U4
LDO 5V->A3V3: C24 C25 C34-C36 U5
LDO 3V3->1V8: C29 C30 C37-C39 U6

### Nets
1V8: C29.2 C30.2 U6.1(OUT) U6.3(SENSE/FB) U6.20(OUT)
3V3: C11.2 C12.2 C13.2 C14.2 C15.2 C19.2 C20.2 C21.2 C31.2 C32.2 C33.2 C37.2 R11.2 R13.2 R16.2 R17.2 U2.2(VLDOIN) U2.7(EN) U2.10(VIN) U3.5(VO) U3.6(Sense+) U4.2(VLDOIN) U4.7(EN) U4.10(VIN) U6.13(EN) U6.15(IN) U6.16(IN)
5V5: C5.1 C6.2 C7.2 C8.2 C9.2 C10.2 C34.2 U1.5(Vo_Sense) U1.6(Vo) U3.2(VI) U5.13(EN) U5.15(IN) U5.16(IN)
24V: C4.2 U1.2(Vi) U1.3(~{Inhibit})
A3V3: C24.2 C25.2 U5.1(OUT) U5.3(SENSE/FB) U5.20(OUT)
DDR3_0V75: C26.2 C27.2 C28.2 U4.3(VO) U4.5(VOSNS)
DDR3_1V5: C16.2 C17.2 C18.2 U2.3(VO) U2.5(VOSNS)
GND: C4.1 C5.2 C6.1 C7.1 C8.1 C9.1 C10.1 C11.1 C12.1 C13.1 C14.1 C15.1 C16.1 C17.1 C18.1 C19.1 C20.1 C21.1 C22.1 C23.1 C24.1 C25.1 C26.1 C27.1 C28.1 C29.1 C30.1 C31.1 C32.1 C33.1 C34.1 C35.1 C36.1 C37.1 C38.1 C39.1 C40.1 C41.1 R12.1 R14.1 R15.1 R18.1 U1.1(GND) U1.7(GND) U2.4(PGND) U2.8(GND) U2.11(EP) U3.1(SmartSync) U3.3(GND) U3.4(GND) U3.7(Sense-) U4.4(PGND) U4.8(GND) U4.11(EP) U5.6(3P2V) U5.7(GND) U5.12(0P1V) U5.E1(PAD) U6.7(GND) U6.8(1P6V) U6.11(0P2V) U6.E1(PAD)
NetC22_2: C22.2 R13.1 R15.2 U2.1(REFIN)
NetC23_2: C23.2 U2.6(REFOUT)
NetC35_2: C35.2 C36.2 U5.14(NR)
NetC38_2: C38.2 C39.2 U6.14(NR)
NetC40_2: C40.2 R17.1 R18.2 U4.1(REFIN)
NetC41_2: C41.2 U4.6(REFOUT)
NetR11_1: R11.1 U2.9(PGOOD)
NetR12_2: R12.2 U1.4(Vo_Adjust)
NetR14_2: R14.2 U3.8(VO_Adj)
NetR16_1: R16.1 U4.9(PGOOD)

Not connected (* = marked no-connect by the designer): U3 9(TurboTrans)* 10(Track)* 11(Inhibit/UVLO)*; U5 2(NC)* 4(6P4V2)* 5(6P4V1)* 8(1P6V)* 9(0P8V)* 10(0P4V)* 11(0P2V)* 17(NC)* 18(NC)* 19(NC)*; U6 2(NC)* 4(6P4V2)* 5(6P4V1)* 6(3P2V)* 9(0P8V)* 10(0P4V)* 12(0P1V)* 17(NC)* 18(NC)* 19(NC)*

### Notes on the sheet
- Fs = 550kHz
  85% Eff
  30mVpp Ripple
- 10,495 mA @ VBAT
- Input Power
- Output Power
- 18,55 mA @ 1V8D
- Sense must be connected to the point of load to maximize accuracy
- 54% Eff
  Pd = (3.3-1.8)*0.6 = 0.9W
  25 + 32.5°C/W * 0.9W = 54.25°C
- 66% Eff
  Pd = (5-3.3)*0.4 = 0.68W
  25 + 32.5°C/W * 0.68W = 47.1°C
- Sheet Name
- Project Title
- Global Project
- Size
- Group
- Revision
- Date
- Sheet
- of
- Filename
- Designers
- (in symbol REG_SWR_PTH08T241WAZ) SWR
- (in symbol REG_SWR_PTN78020WAH) SWR

### Library data of the parts
C4 C16-C41 = CAP - 0603: Precision: 10%; Current: *; CreatedBy: Jonathan Bouchard; Power: *
C5 = CAP_ALU_MAL214699501E3: CAP - ALU 330uF 20% 16V - 1010; Current: 750mA; Mfg: Vishay Dale; Mfg Part Number: MAL214699501E3; HelpURL: http://www.vishay.com/docs/28403/146cti.pdf; CreatedBy: Jonathan Bouchard; Temperature: -55°C to 125°C; Power: *; Supplier 1: Digikey; Supplier Part Number 1: 4405PHCT-ND
C6-C15 = CAP - 1206: Precision: 10%; Current: *; CreatedBy: Jonathan Bouchard; Power: *
U1 = REG_SWR_PTN78020WAH: REG - DC DC CONVERTER 2.5-12.6V 6A - TH; Manufacturer #1: Texas Instruments; Value: 7V ~ 36V -> 2.5 ~ 12.6V; Voltage Rating: 36V; Power Max: 90 W; GRAMS Lib Spec: 2.8; Magnetic Material: Yes; Cryo: UNKNOWN; Tolerance: -; Current Rating: 6A; HelpURL: http://www.ti.com/lit/ds/symlink/ptn78020h.pdf; CreatedBy/Date: Arnaud_Samson_2019-07-09; VerifiedBy: c.Paulin - 15 juillet 2019; Temperature: -40°C ~ 85°C; Package: TH; Manufacturer #2: -; Assembly Type: TH; Part Number #2: -; Part Number #1: PTN78020WAH; Polarized: Yes; Supplier 1: Digi-Key; Supplier Part Number 1: 296-20515-ND
U2 U4 = REG_PMIC_TPS51200DRCT: REG - DDR TERMINATION/REF REG - 10-VFDFN; Manufacturer #1: Texas Instruments; Value: DDR, DDR2, DDR3(L), DDR4; Voltage Rating: 2.375V ~ 3.5V; Current Rating: Source: 3A~4.5A, Sink: 3.5A~5.5A; GRAMS Lib Spec: 2.8; Magnetic Material: Unknown; Polarized: Yes; Tolerance: *; Power Max: *; HelpURL: http://www.ti.com/lit/ds/symlink/tps51200.pdf; CreatedBy/Date: Joel Lemay 2019-03-19; VerifiedBy: Nicolas V. (2019-05-31); Temperature: -40°C ~ 85°C; Package: 10-VFDFN; Manufacturer #2: *; Note: *; Assembly Type: SMD; Part Number #2: *; Part Number #1: TPS51200DRCT; Supplier 1: Digi-Key; Supplier Part Number 1: 296-23830-1-ND; Cryo: UNKNOWN
U3 = REG_SWR_PTH08T241WAZ: REG - MODULE PIP 10A 14VIN - 11-SMD; Manufacturer #1: Texas Instruments; Current Rating: 10A (out); Voltage rating: 4.5-14V (Input), 0.69 - 5.5V (Out); Polarized: Yes; Magnetic Material: UNKNOWN; Manufacturer #2: *; Note: *; Power Max: *; Value: *; Part Number #1: PTH08T241WAZ; Part Number #2: *; HelpURL: http://www.ti.com/lit/ds/symlink/pth08t241w.pdf; Supplier 1: Digi-Key; Supplier Part Number 1: 296-21339-ND; Assembly Type: SMD; Temperature: -40°C ~ 85°C; Package: SMD; CreatedBy/Date: Olivier Bernard / 6/5/2018; VerifiedBy: Caroline Paulin / 10 juillet 2018; Cryo: UNKNOWN
U5 U6 = REG_LDO_TPS7A4701RGWR: REG - LINEAR POS ADJ 1A - 20VQFN; Manufacturer #1: Texas Instruments; GRAMS Lib Spec: 2.8; Magnetic Material: Unknown; Polarized: Yes; Value: 1.4 à 34V; Voltage rating: 35V max; Assembly Type: SMD; CreatedBy/Date: L-P Gauthier / 2018-05-29; Current Rating: 1A; Manufacturer #2: TBD; Part Number #1: TPS7A4701RGWR; Part Number #2: TBD; Package: 20-VQFN Exposed Pad; Power Max: *; Tolerance: -; Supplier 1: Digi-Key; Supplier Part Number 1: 296-37224-1-ND; VerifiedBy: Caroline Paulin - 28 sept 2018; Temperature: -40°C ~ 125°C; HelpURL: http://www.ti.com/lit/ds/symlink/tps7a47.pdf; Cryo: UNKNOWN
R11-R18 = RES - 0603: Current: *; CreatedBy: Jonathan Bouchard

## Sheet APP_1_Ethernet_m.SchDoc
size Tabloid; SheetNumber: 11; SheetTotal: 16; Sheet_Name: Ethernet; Size: 11x17
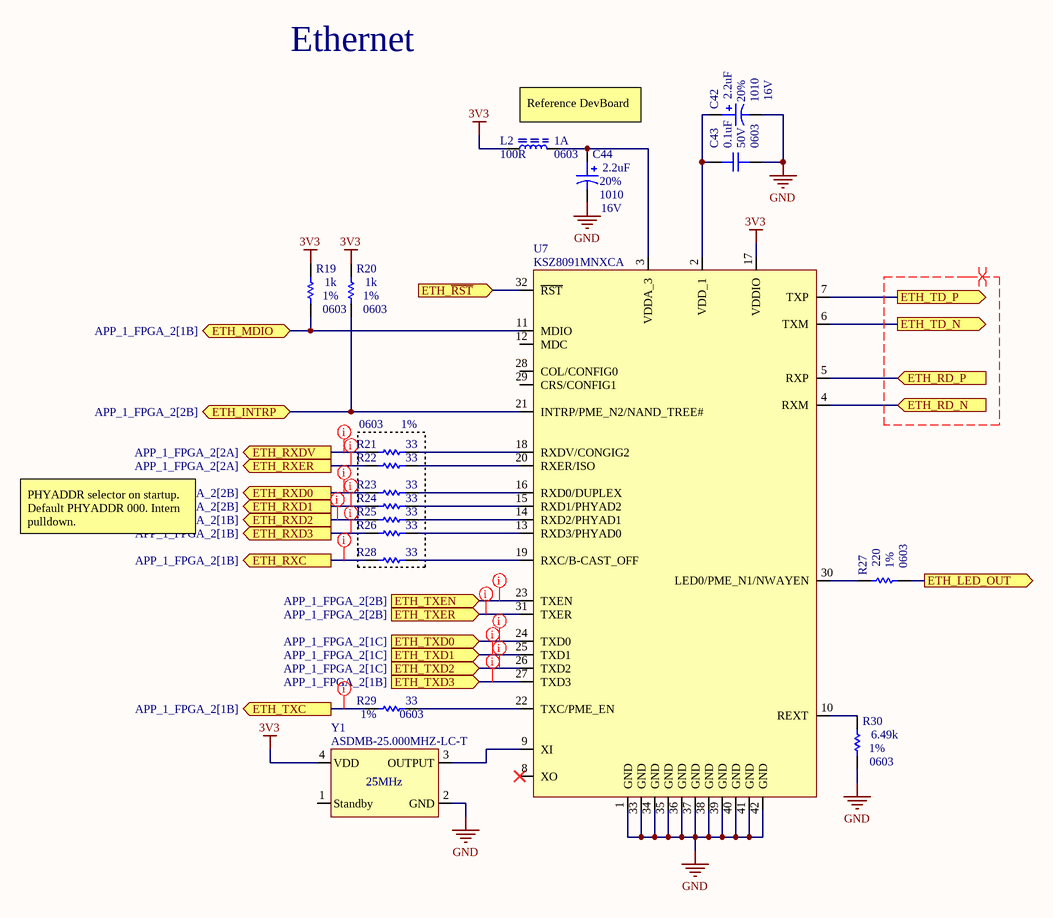
[diagram p9: APP_1_Ethernet_m.SchDoc]

### Parts
C42  value 2.2uF  Voltage: 16V  Package: 1010  Precision: 20%  [CAP_ALU_1010_vishay]  (hidden comment: MAL214699501E3)
C43  value 0.1uF  Voltage: 50V  Package: 0603  [CAP_0603]  (hidden comment: CAP - 0603)
C44  value 2.2uF  Voltage: 16V  Package: 1010  Precision: 20%  [CAP_ALU_1010_vishay]  (hidden comment: MAL214699501E3)
L2  value 100R  Current: 1A  Package: 0603  [FER_0603]  (hidden comment: FER - 0603)
R19  value 1k  Package: 0603  Precision: 1%  [RES_0603]  (hidden comment: RES - 0603)
R20  value 1k  Package: 0603  Precision: 1%  [RES_0603]  (hidden comment: RES - 0603)
R21  value 33  Package: 0603  Precision: 1%  [RES_0603]  (hidden comment: RES - 0603)
R22  value 33  [RES_0603]  (hidden comment: RES - 0603)
R23  value 33  [RES_0603]  (hidden comment: RES - 0603)
R24  value 33  [RES_0603]  (hidden comment: RES - 0603)
R25  value 33  [RES_0603]  (hidden comment: RES - 0603)
R26  value 33  [RES_0603]  (hidden comment: RES - 0603)
R27  value 220  Package: 0603  Precision: 1%  [RES_0603]  (hidden comment: RES - 0603)
R28  value 33  [RES_0603]  (hidden comment: RES - 0603)
R29  value 33  Package: 0603  Precision: 1%  [RES_0603]  (hidden comment: RES - 0603)
R30  value 6.49k  Package: 0603  Precision: 1%  [RES_0603]  (hidden comment: RES - 0603)
U7  KSZ8091MNXCA  [COM_ETH_PHY_KSZ8091MNXCA]
Y1  ASDMB-25.000MHZ-LC-T  [OSC_ASDMB-25.000MHZ-LC-T]

### Ports
ETH_INTRP (bidir, see APP_1_FPGA_2[2B]), ETH_LED_OUT (out), ETH_MDIO (bidir, see APP_1_FPGA_2[1B]), ETH_RD_N (in, see APP_1_Connectors_m[6B]), ETH_RD_P (in, see APP_1_Connectors_m[6B]), ETH_RXC (out, see APP_1_FPGA_2[1B]), ETH_RXD0 (out, see APP_1_FPGA_2[2B]), ETH_RXD1 (out, see APP_1_FPGA_2[2B]), ETH_RXD2 (out, see APP_1_FPGA_2[1B]), ETH_RXD3 (out, see APP_1_FPGA_2[1B]), ETH_RXDV (out, see APP_1_FPGA_2[2A]), ETH_RXER (out, see APP_1_FPGA_2[2A]), ETH_TD_N (out, see APP_1_Connectors_m[6B]), ETH_TD_P (out, see APP_1_Connectors_m[6B]), ETH_TXC (out, see APP_1_FPGA_2[1B]), ETH_TXD0 (in, see APP_1_FPGA_2[1C]), ETH_TXD1 (in, see APP_1_FPGA_2[1C]), ETH_TXD2 (in, see APP_1_FPGA_2[1C]), ETH_TXD3 (in, see APP_1_FPGA_2[1B]), ETH_TXEN (in, see APP_1_FPGA_2[2B]), ETH_TXER (in, see APP_1_FPGA_2[2B]), ETH_~{RST} (in)

### Nets
3V3: L2.2 R19.2 R20.2 U7.17(VDDIO) Y1.4(VDD)
GND: C42.2 C43.1 C44.2 R30.1 U7.1(GND) U7.33(GND) U7.34(GND) U7.35(GND) U7.36(GND) U7.37(GND) U7.38(GND) U7.39(GND) U7.40(GND) U7.41(GND) U7.42(GND) Y1.2(GND)
ETH_INTRP: R20.1 U7.21(INTRP/PME_N2/NAND_TREE#) ; port ETH_INTRP
ETH_LED_OUT: R27.1 ; port ETH_LED_OUT
ETH_MDIO: R19.1 U7.11(MDIO) ; port ETH_MDIO
ETH_~{RST}: U7.32(~{RST}) ; port ETH_~{RST}
ETH_RD_N: U7.4(RXM) ; port ETH_RD_N
ETH_RD_P: U7.5(RXP) ; port ETH_RD_P
ETH_RXC: R28.2 ; port ETH_RXC
ETH_RXD0: R23.2 ; port ETH_RXD0
ETH_RXD1: R24.2 ; port ETH_RXD1
ETH_RXD2: R25.2 ; port ETH_RXD2
ETH_RXD3: R26.2 ; port ETH_RXD3
ETH_RXDV: R21.2 ; port ETH_RXDV
ETH_RXER: R22.2 ; port ETH_RXER
ETH_TD_N: U7.6(TXM) ; port ETH_TD_N
ETH_TD_P: U7.7(TXP) ; port ETH_TD_P
ETH_TXC: R29.2 ; port ETH_TXC
ETH_TXD0: U7.24(TXD0) ; port ETH_TXD0
ETH_TXD1: U7.25(TXD1) ; port ETH_TXD1
ETH_TXD2: U7.26(TXD2) ; port ETH_TXD2
ETH_TXD3: U7.27(TXD3) ; port ETH_TXD3
ETH_TXEN: U7.23(TXEN) ; port ETH_TXEN
ETH_TXER: U7.31(TXER) ; port ETH_TXER
NetC42_1: C42.1 C43.2 U7.2(VDD_1)
NetC44_1: C44.1 L2.1 U7.3(VDDA_3)
NetR21_1: R21.1 U7.18(RXDV/CONGIG2)
NetR22_1: R22.1 U7.20(RXER/ISO)
NetR23_1: R23.1 U7.16(RXD0/DUPLEX)
NetR24_1: R24.1 U7.15(RXD1/PHYAD2)
NetR25_1: R25.1 U7.14(RXD2/PHYAD1)
NetR26_1: R26.1 U7.13(RXD3/PHYAD0)
NetR27_2: R27.2 U7.30(LED0/PME_N1/NWAYEN)
NetR28_1: R28.1 U7.19(RXC/B-CAST_OFF)
NetR29_1: R29.1 U7.22(TXC/PME_EN)
NetR30_2: R30.2 U7.10(REXT)
NetU7_9: U7.9(XI) Y1.3(OUTPUT)

Not connected (* = marked no-connect by the designer): U7 8(XO)* 12(MDC) 28(COL/CONFIG0) 29(CRS/CONFIG1); Y1 1(Standby)

### Layout directives
differential pair: (no net found under the mark)
net class ETH_RX: ETH_RXC, ETH_RXD0, ETH_RXD1, ETH_RXD2, ETH_RXD3, ETH_RXDV, ETH_RXER
net class ETH_TX: ETH_TXC, ETH_TXD0, ETH_TXD1, ETH_TXD2, ETH_TXD3, ETH_TXEN, ETH_TXER

### Notes on the sheet
- Ethernet
- Reference DevBoard
- PHYADDR selector on startup. Default PHYADDR 000. Intern pulldown.
- Sheet Name
- Project Title
- Global Project
- Size
- Group
- Revision
- Date
- Sheet
- of
- Filename
- Designers

### Library data of the parts
C42 C44 = CAP_ALU_MAL214699501E3: as C5 on sheet APP_1_Power_m; Mfg Part Number: MAL214699501E3; HelpURL: http://www.vishay.com/docs/28403/146cti.pdf; CreatedBy: Jonathan Bouchard; Temperature: -55°C to 125°C; Power: *; Supplier 1: Digikey; Supplier Part Number 1: 4405PHCT-ND
C43 = CAP - 0603: Precision: 10%; Current: *; CreatedBy: Jonathan Bouchard; Power: *
R22-R26 R28 = RES - 0603: Precision: 1%; Current: *; CreatedBy: Jonathan Bouchard; Package: 0603
U7 = COM_ETH_PHY_KSZ8091MNXCA: COM - ETHERNET PHY 10/100 - QFN-32; Voltage: 1.8V, 2.5V, 3.3V; Mfg: Micrel; Current: *; Power: *; Mfg Part Number: KSZ8091MNXCA; HelpURL: http://ww1.microchip.com/downloads/en/DeviceDoc/00002275A.pdf; CreatedBy: Jonathan Bouchard; Temperature: 0°C ~ 70°C; Value: *; Precision: *; Package: QFN-32; Supplier 1: Digikey; Supplier Part Number 1: 576-4356-ND
Y1 = OSC_ASDMB-25.000MHZ-LC-T: OSC - 25MHz XO (Standard) LVCMOS - 4-SMD, No Lead; Manufacturer #1: Abracon LLC; Tolerance: ±50ppm; Voltage Rating: 1.8V ~ 3.3V; GRAMS Lib Spec: 2.8; Magnetic Material: Unknown; Polarized: Yes; Value: 25MHz; Current Rating: *; Power Max: *; HelpURL: https://abracon.com/Oscillators/ASDMB.pdf; CreatedBy/Date: Joël Lemay 2019-03-29; VerifiedBy: C. Paulin - 29 mai 2019; Temperature: -40°C ~ +85°C; Package: 4-SMD, No Lead; Manufacturer #2: *; Note: *; Assembly Type: SMD; Part Number #2: *; Part Number #1: ASDMB-25.000MHZ-LC-T; Supplier 1: Digi-Key; Supplier Part Number 1: 535-11730-1-ND; Cryo: UNKNOWN
L2 = FER - 0603: Voltage: *; CreatedBy: Jonathan Bouchard; Power: *; Precision: *
R19-R21 R27 R29 R30 = RES - 0603: Current: *; CreatedBy: Jonathan Bouchard

## Sheet APP_1_Flash_m.SchDoc
size Tabloid; SheetNumber: 12; SheetTotal: 14; Sheet_Name: FLASH; Size: 11x17
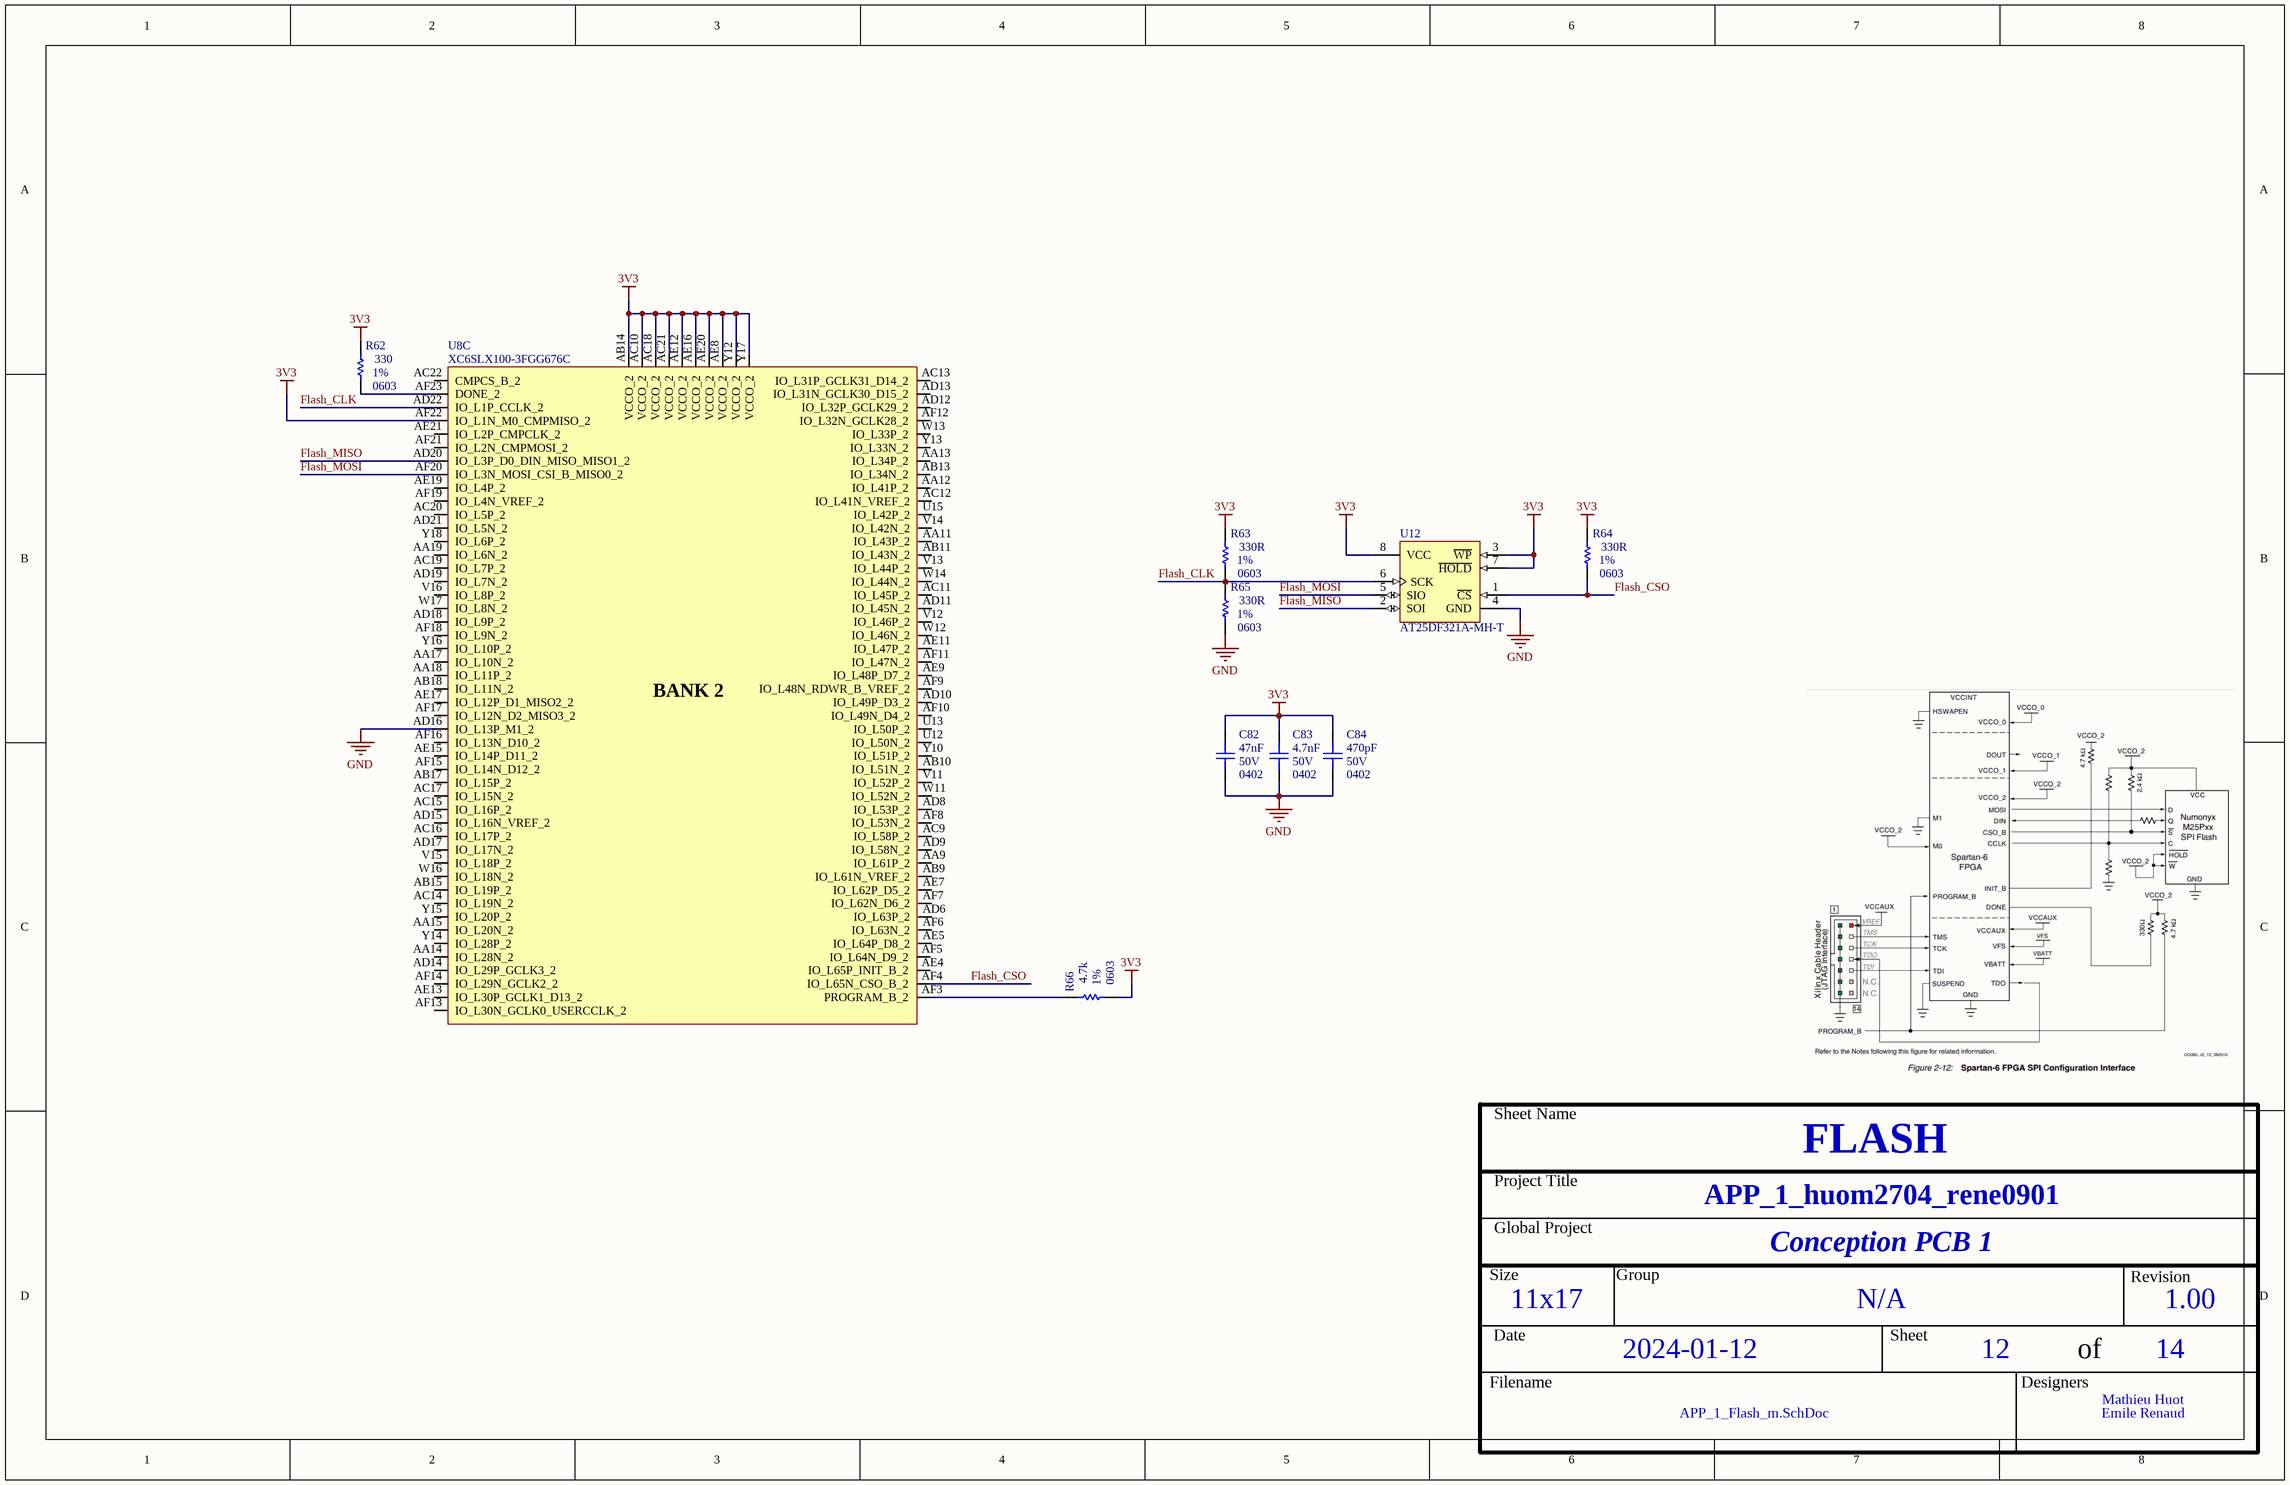
[diagram p10: APP_1_Flash_m.SchDoc]

### Parts
C82  value 47nF  Voltage: 50V  Package: 0402  [CAP_0402]  (hidden comment: CAP - 0402)
C83  value 4.7nF  Voltage: 50V  Package: 0402  [CAP_0402]  (hidden comment: CAP - 0402)
C84  value 470pF  Voltage: 50V  Package: 0402  [CAP_0402]  (hidden comment: CAP - 0402)
R62  value 330  Package: 0603  Precision: 1%  [RES_0603]  (hidden comment: RES - 0603)
R63  value 330R  Package: 0603  Precision: 1%  [RES_0603]  (hidden comment: RES - 0603)
R64  value 330R  Package: 0603  Precision: 1%  [RES_0603]  (hidden comment: RES - 0603)
R65  value 330R  Package: 0603  Precision: 1%  [RES_0603]  (hidden comment: RES - 0603)
R66  value 4.7k  Package: 0603  Precision: 1%  [RES_0603]  (hidden comment: RES - 0603)
U8  XC6SLX100-3FGG676C  [FPGA_XILINX_FGG676]  (part C of 10)
U12  AT25DF321A-MH-T  [8MA1_UDFN_REN-L]

### Nets
3V3: C82.2 C83.2 C84.2 R62.2 R63.2 R64.2 R66.1 U8.AB14(VCCO_2) U8.AC10(VCCO_2) U8.AC18(VCCO_2) U8.AC21(VCCO_2) U8.AE8(VCCO_2) U8.AE12(VCCO_2) U8.AE16(VCCO_2) U8.AE20(VCCO_2) U8.AF22(IO_L1N_M0_CMPMISO_2) U8.Y12(VCCO_2) U8.Y17(VCCO_2) U12.3(~{WP}) U12.7(~{HOLD}) U12.8(VCC)
GND: C82.1 C83.1 C84.1 R65.1 U8.AD16(IO_L13P_M1_2) U12.4(GND)
Flash_CLK: R63.1 R65.2 U8.AD22(IO_L1P_CCLK_2) U12.6(SCK)
Flash_CSO: R64.1 U8.AF4(IO_L65N_CSO_B_2) U12.1(~{CS})
Flash_MISO: U8.AD20(IO_L3P_D0_DIN_MISO_MISO1_2) U12.2(SOI)
Flash_MOSI: U8.AF20(IO_L3N_MOSI_CSI_B_MISO0_2) U12.5(SIO)
NetR62_1: R62.1 U8.AF23(DONE_2)
NetR66_2: R66.2 U8.AF3(PROGRAM_B_2)

Not connected (* = marked no-connect by the designer): U8 AA9(IO_L61P_2) AA11(IO_L43P_2) AA12(IO_L41P_2) AA13(IO_L34P_2) AA14(IO_L28N_2) AA15(IO_L20N_2) AA17(IO_L10N_2) AA18(IO_L11P_2) AA19(IO_L6N_2) AB9(IO_L61N_VREF_2) AB10(IO_L51N_2) AB11(IO_L43N_2) AB13(IO_L34N_2) AB15(IO_L19P_2) AB17(IO_L15P_2) AB18(IO_L11N_2) AC9(IO_L58P_2) AC11(IO_L45P_2) AC12(IO_L41N_VREF_2) AC13(IO_L31P_GCLK31_D14_2) AC14(IO_L19N_2) AC15(IO_L16P_2) AC16(IO_L17P_2) AC17(IO_L15N_2) AC19(IO_L7P_2) AC20(IO_L5P_2) AC22(CMPCS_B_2) AD6(IO_L63P_2) AD8(IO_L53P_2) AD9(IO_L58N_2) AD10(IO_L49P_D3_2) AD11(IO_L45N_2) AD12(IO_L32P_GCLK29_2) AD13(IO_L31N_GCLK30_D15_2) AD14(IO_L29P_GCLK3_2) AD15(IO_L16N_VREF_2) AD17(IO_L17N_2) AD18(IO_L9P_2) AD19(IO_L7N_2) AD21(IO_L5N_2) AE4(IO_L65P_INIT_B_2) AE5(IO_L64P_D8_2) AE7(IO_L62P_D5_2) AE9(IO_L48P_D7_2) AE11(IO_L47P_2) AE13(IO_L30P_GCLK1_D13_2) AE15(IO_L14P_D11_2) AE17(IO_L12P_D1_MISO2_2) AE19(IO_L4P_2) AE21(IO_L2P_CMPCLK_2) AF5(IO_L64N_D9_2) AF6(IO_L63N_2) AF7(IO_L62N_D6_2) AF8(IO_L53N_2) AF9(IO_L48N_RDWR_B_VREF_2) AF10(IO_L49N_D4_2) AF11(IO_L47N_2) AF12(IO_L32N_GCLK28_2) AF13(IO_L30N_GCLK0_USERCCLK_2) AF14(IO_L29N_GCLK2_2) AF15(IO_L14N_D12_2) AF16(IO_L13N_D10_2) AF17(IO_L12N_D2_MISO3_2) AF18(IO_L9N_2) AF19(IO_L4N_VREF_2) AF21(IO_L2N_CMPMOSI_2) U12(IO_L50N_2) U13(IO_L50P_2) U15(IO_L42P_2) V11(IO_L52P_2) V12(IO_L46P_2) V13(IO_L44P_2) V14(IO_L42N_2) V15(IO_L18P_2) V16(IO_L8P_2) W11(IO_L52N_2) W12(IO_L46N_2) W13(IO_L33P_2) W14(IO_L44N_2) W16(IO_L18N_2) W17(IO_L8N_2) Y10(IO_L51P_2) Y13(IO_L33N_2) Y14(IO_L28P_2) Y15(IO_L20P_2) Y16(IO_L10P_2) Y18(IO_L6P_2)

### Notes on the sheet
- Sheet Name
- Project Title
- Global Project
- Size
- Group
- Revision
- Date
- Sheet
- of
- Filename
- Designers
- (in symbol FPGA_XC6SLX100-3FGG676C, part C) BANK 2

### Library data of the parts
C82-C84 = CAP - 0402: Precision: 10%; Current: *; CreatedBy: Jonathan Bouchard
  C82 C83: Power: *
U8 = FPGA_XC6SLX100-3FGG676C: FPGA - XILINX SPARTAN 6 480 I/O - BGA-676; Voltage: 1.14 V ~ 1.26 V; Current: *; Power: *; Mfg: Xilinx; Mfg Part Number: XC6SLX100-3FGG676C; HelpURL: https://www.xilinx.com/support/documentation/data_sheets/ds162.pdf; CreatedBy: Jonathan Bouchard; Temperature: 0°C ~ 85°C (TJ); Value: *; Precision: *; Package: BGA-676; Supplier 1: Digikey; Supplier Part Number 1: 122-1760-ND
U12 = FLA_AT25DF321A-MH-T: SPI Serial Flash Memory, 32 Megabit, 100 MHz, 2.7 to 3.6 V, -40 to 85 degC, 8-Pin UDFN (MA1-8), RoHS, Tape and Reel; Manufacturer: Adesto; Max. Freq: 100 MHz; Packing: Tape and Reel; PackageVersion: Rev. D; PartNumber: AT25DF321A-MH-T; RoHS: TRUE; PackageReference: MA1-8; ComponentLink2Description: Datasheet; Device Density: 32 Megabit; PackageDescription: 8-Pin Thermally Enhanced Plastic Ultra Thin Dual Flat No Lead Package, Body 5 x 6 mm, Pitch 1.27 mm; ComponentLink2URL: http://www.adestotech.com/sites/default/files/datasheets/doc3686.pdf; DatasheetVersion: Rev. 3686E; Mounting Technology: Surface Mount; ComponentLink1URL: http://www.adestotech.com/; ComponentLink1Description: Manufacturer URL; Interface: Serial; ComponentLink3Description: Package Specification; Operating Temperature: -40 to 85 degC; Operating Voltage: 2.7 to 3.6 V; ComponentLink3URL: http://www.adestotech.com/sites/default/files/datasheets/doc3668.pdf
R62-R66 = RES - 0603: Current: *; CreatedBy: Jonathan Bouchard

## Sheet APP_1_DAC_m.SchDoc
size Tabloid; SheetNumber: 13; SheetTotal: 14; Sheet_Name: DAC; Size: 11x17
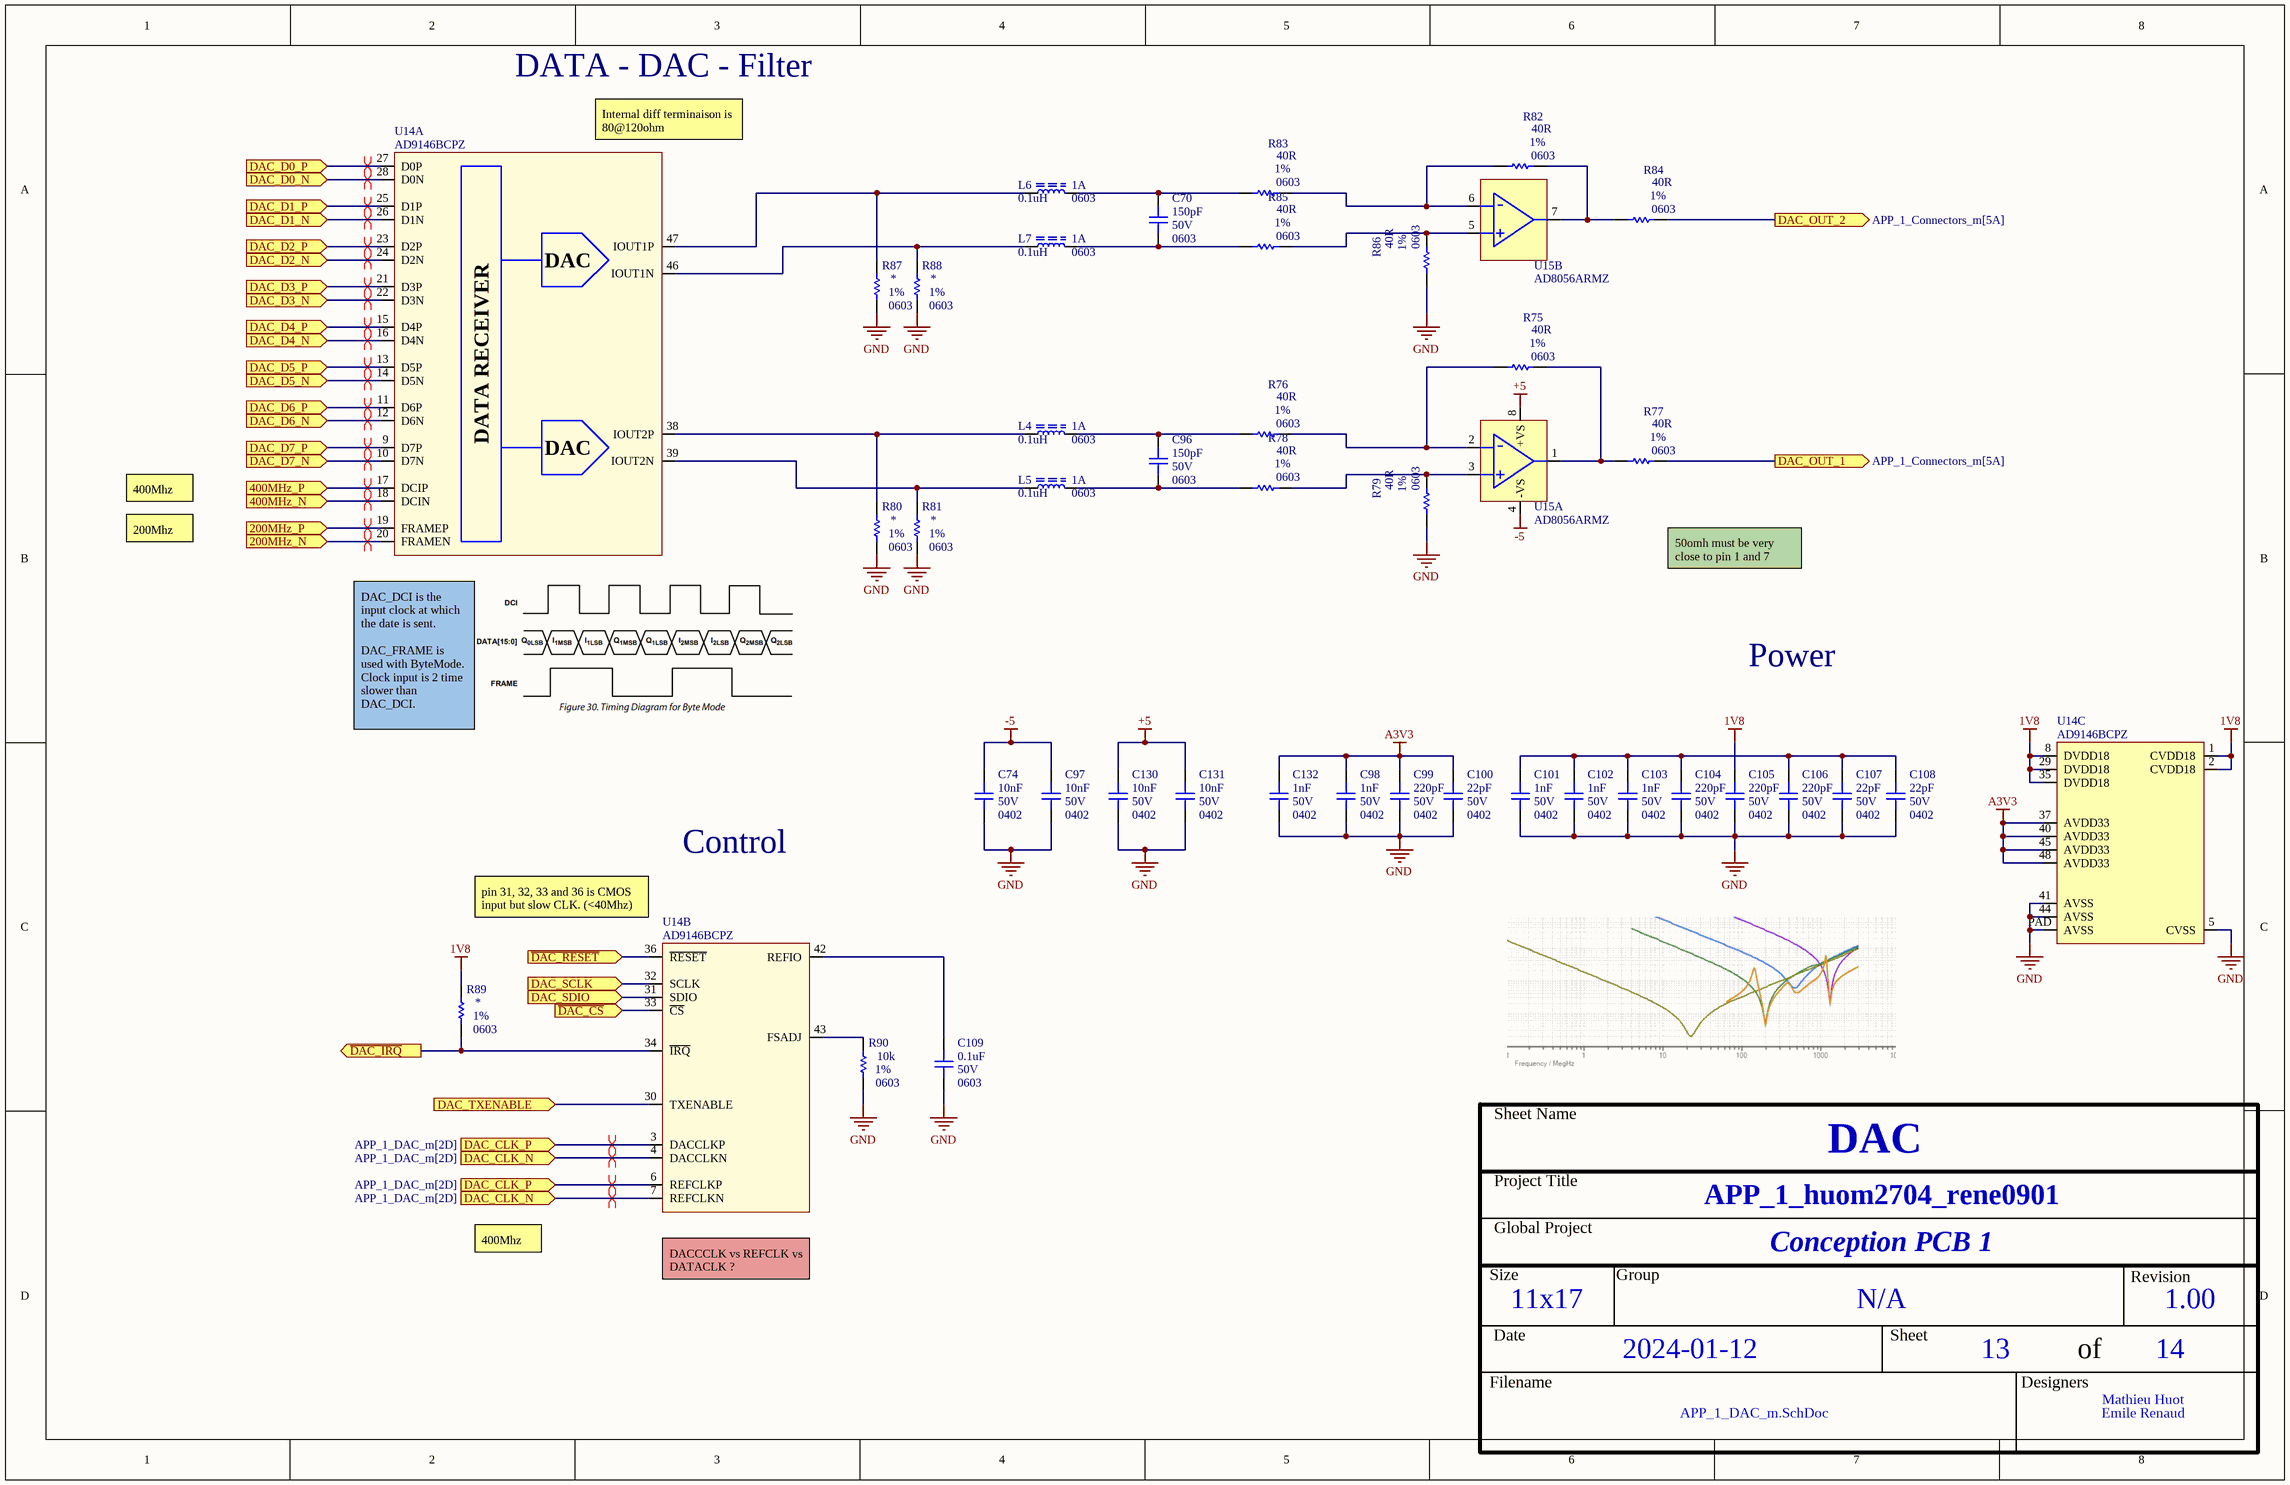
[diagram p11: APP_1_DAC_m.SchDoc]

### Parts
(Parts that share a designator on the sheet are numbered #1, #2 ... from top to bottom, then left to right.)
C70#2  value 150pF  Voltage: 50V  Package: 0603  [CAP_0603]  (hidden comment: CAP - 0603)
C74#2  value 10nF  Voltage: 50V  Package: 0402  [CAP_0402]  (hidden comment: CAP - 0402)
C96  value 150pF  Voltage: 50V  Package: 0603  [CAP_0603]  (hidden comment: CAP - 0603)
C97  value 10nF  Voltage: 50V  Package: 0402  [CAP_0402]  (hidden comment: CAP - 0402)
C98  value 1nF  Voltage: 50V  Package: 0402  [CAP_0402]  (hidden comment: CAP - 0402)
C99  value 220pF  Voltage: 50V  Package: 0402  [CAP_0402]  (hidden comment: CAP - 0402)
C100  value 22pF  Voltage: 50V  Package: 0402  [CAP_0402]  (hidden comment: CAP - 0402)
C101  value 1nF  Voltage: 50V  Package: 0402  [CAP_0402]  (hidden comment: CAP - 0402)
C102  value 1nF  Voltage: 50V  Package: 0402  [CAP_0402]  (hidden comment: CAP - 0402)
C103  value 1nF  Voltage: 50V  Package: 0402  [CAP_0402]  (hidden comment: CAP - 0402)
C104  value 220pF  Voltage: 50V  Package: 0402  [CAP_0402]  (hidden comment: CAP - 0402)
C105  value 220pF  Voltage: 50V  Package: 0402  [CAP_0402]  (hidden comment: CAP - 0402)
C106  value 220pF  Voltage: 50V  Package: 0402  [CAP_0402]  (hidden comment: CAP - 0402)
C107  value 22pF  Voltage: 50V  Package: 0402  [CAP_0402]  (hidden comment: CAP - 0402)
C108  value 22pF  Voltage: 50V  Package: 0402  [CAP_0402]  (hidden comment: CAP - 0402)
C109  value 0.1uF  Voltage: 50V  Package: 0603  [CAP_0603]  (hidden comment: CAP - 0603)
C130  value 10nF  Voltage: 50V  Package: 0402  [CAP_0402]  (hidden comment: CAP - 0402)
C131  value 10nF  Voltage: 50V  Package: 0402  [CAP_0402]  (hidden comment: CAP - 0402)
C132  value 1nF  Voltage: 50V  Package: 0402  [CAP_0402]  (hidden comment: CAP - 0402)
L4  value 0.1uH  Current: 1A  Package: 0603  [FER_0603]  (hidden comment: FER - 0603)
L5  value 0.1uH  Current: 1A  Package: 0603  [FER_0603]  (hidden comment: FER - 0603)
L6  value 0.1uH  Current: 1A  Package: 0603  [FER_0603]  (hidden comment: FER - 0603)
L7  value 0.1uH  Current: 1A  Package: 0603  [FER_0603]  (hidden comment: FER - 0603)
R75  value 40R  Package: 0603  Precision: 1%  [RES_0603]  (hidden comment: RES - 0603)
R76  value 40R  Package: 0603  Precision: 1%  [RES_0603]  (hidden comment: RES - 0603)
R77  value 40R  Package: 0603  Precision: 1%  [RES_0603]  (hidden comment: RES - 0603)
R78  value 40R  Package: 0603  Precision: 1%  [RES_0603]  (hidden comment: RES - 0603)
R79  value 40R  Package: 0603  Precision: 1%  [RES_0603]  (hidden comment: RES - 0603)
R80  Package: 0603  Precision: 1%  [RES_0603]  (hidden comment: RES - 0603)
R81  Package: 0603  Precision: 1%  [RES_0603]  (hidden comment: RES - 0603)
R82  value 40R  Package: 0603  Precision: 1%  [RES_0603]  (hidden comment: RES - 0603)
R83  value 40R  Package: 0603  Precision: 1%  [RES_0603]  (hidden comment: RES - 0603)
R84  value 40R  Package: 0603  Precision: 1%  [RES_0603]  (hidden comment: RES - 0603)
R85  value 40R  Package: 0603  Precision: 1%  [RES_0603]  (hidden comment: RES - 0603)
R86  value 40R  Package: 0603  Precision: 1%  [RES_0603]  (hidden comment: RES - 0603)
R87  Package: 0603  Precision: 1%  [RES_0603]  (hidden comment: RES - 0603)
R88  Package: 0603  Precision: 1%  [RES_0603]  (hidden comment: RES - 0603)
R89  Package: 0603  Precision: 1%  [RES_0603]  (hidden comment: RES - 0603)
R90  value 10k  Package: 0603  Precision: 1%  [RES_0603]  (hidden comment: RES - 0603)
U14  AD9146BCPZ  [DAC_AD9146BCPZ]  (parts A,B,C of 3)
U15  AD8056ARMZ  [OPAMP_AD8056ARMZ]  (parts A,B of 2)

### Ports
200MHz_N (in, see APP_1_PLL_m[3C]), 200MHz_P (in, see APP_1_PLL_m[3C]), 400MHz_N (in, see APP_1_PLL_m[3C]), 400MHz_P (in, see APP_1_PLL_m[3C]), DAC_CLK_N (in, see APP_1_DAC_m[2D]), DAC_CLK_P (in, see APP_1_DAC_m[2D]), DAC_D0_N (in), DAC_D0_P (in), DAC_D1_N (in), DAC_D1_P (in), DAC_D2_N (in), DAC_D2_P (in), DAC_D3_N (in), DAC_D3_P (in), DAC_D4_N (in), DAC_D4_P (in), DAC_D5_N (in), DAC_D5_P (in), DAC_D6_N (in), DAC_D6_P (in), DAC_D7_N (in), DAC_D7_P (in), DAC_OUT_1 (out, see APP_1_Connectors_m[5A]), DAC_OUT_2 (out, see APP_1_Connectors_m[5A]), DAC_SCLK (in), DAC_SDIO (in), DAC_TXENABLE (in), ~{DAC_CS} (in), ~{DAC_IRQ} (out), ~{DAC_RESET} (in)

### Nets
1V8: C105.2 R89.2 U14.1(CVDD18) U14.2(CVDD18) U14.8(DVDD18) U14.29(DVDD18) U14.35(DVDD18)
+5: C130.2 C131.2 U15.8(+VS)
-5: C74#2.2 C97.2 U15.4(-VS)
A3V3: C98.2 C99.2 C100.2 C132.2 U14.37(AVDD33) U14.40(AVDD33) U14.45(AVDD33) U14.48(AVDD33)
GND: C74#2.1 C97.1 C98.1 C99.1 C100.1 C101.1 C102.1 C103.1 C104.1 C105.1 C106.1 C107.1 C108.1 C109.1 C130.1 C131.1 C132.1 R79.2 R80.1 R81.1 R86.2 R87.1 R88.1 R90.1 U14.5(CVSS) U14.41(AVSS) U14.44(AVSS) U14.PAD(AVSS)
200MHz_N: U14.20(FRAMEN) ; port 200MHz_N
200MHz_P: U14.19(FRAMEP) ; port 200MHz_P
400MHz_N: U14.18(DCIN) ; port 400MHz_N
400MHz_P: U14.17(DCIP) ; port 400MHz_P
~{DAC_CS}: U14.33(~{CS}) ; port ~{DAC_CS}
~{DAC_IRQ}: R89.1 U14.34(~{IRQ}) ; port ~{DAC_IRQ}
~{DAC_RESET}: U14.36(~{RESET}) ; port ~{DAC_RESET}
DAC_CLK_N: U14.4(DACCLKN) U14.7(REFCLKN) ; port DAC_CLK_N
DAC_CLK_P: U14.3(DACCLKP) U14.6(REFCLKP) ; port DAC_CLK_P
DAC_D0_N: U14.28(D0N) ; port DAC_D0_N
DAC_D0_P: U14.27(D0P) ; port DAC_D0_P
DAC_D1_N: U14.26(D1N) ; port DAC_D1_N
DAC_D1_P: U14.25(D1P) ; port DAC_D1_P
DAC_D2_N: U14.24(D2N) ; port DAC_D2_N
DAC_D2_P: U14.23(D2P) ; port DAC_D2_P
DAC_D3_N: U14.22(D3N) ; port DAC_D3_N
DAC_D3_P: U14.21(D3P) ; port DAC_D3_P
DAC_D4_N: U14.16(D4N) ; port DAC_D4_N
DAC_D4_P: U14.15(D4P) ; port DAC_D4_P
DAC_D5_N: U14.14(D5N) ; port DAC_D5_N
DAC_D5_P: U14.13(D5P) ; port DAC_D5_P
DAC_D6_N: U14.12(D6N) ; port DAC_D6_N
DAC_D6_P: U14.11(D6P) ; port DAC_D6_P
DAC_D7_N: U14.10(D7N) ; port DAC_D7_N
DAC_D7_P: U14.9(D7P) ; port DAC_D7_P
DAC_OUT_1: R77.1 ; port DAC_OUT_1
DAC_OUT_2: R84.1 ; port DAC_OUT_2
DAC_SCLK: U14.32(SCLK) ; port DAC_SCLK
DAC_SDIO: U14.31(SDIO) ; port DAC_SDIO
DAC_TXENABLE: U14.30(TXENABLE) ; port DAC_TXENABLE
NetC70#2_1: C70#2.1 L7.1 R85.2
NetC70#2_2: C70#2.2 L6.1 R83.2
NetC96_1: C96.1 L5.1 R78.2
NetC96_2: C96.2 L4.1 R76.2
NetC101_2: C101.2 C102.2 C103.2 C104.2 C106.2 C107.2 C108.2
NetC109_2: C109.2 U14.42(REFIO)
NetL4_2: L4.2 R80.2 U14.38(IOUT2P)
NetL5_2: L5.2 R81.2 U14.39(IOUT2N)
NetL6_2: L6.2 R87.2 U14.47(IOUT1P)
NetL7_2: L7.2 R88.2 U14.46(IOUT1N)
NetR75_1: R75.1 R77.2 U15.1(OUT1)
NetR75_2: R75.2 R76.1 U15.2(-IN1)
NetR78_1: R78.1 R79.1 U15.3(+IN1)
NetR82_1: R82.1 R84.2 U15.7(OUT2)
NetR82_2: R82.2 R83.1 U15.6(-IN2)
NetR85_1: R85.1 R86.1 U15.5(+IN2)
NetR90_2: R90.2 U14.43(FSADJ)

### Layout directives
differential pair: 200MHz_N, 200MHz_P, 400MHz_N, 400MHz_P, DAC_CLK_N, DAC_CLK_P, DAC_D0_N, DAC_D0_P, DAC_D1_N, DAC_D1_P, DAC_D2_N, DAC_D2_P, DAC_D3_N, DAC_D3_P, DAC_D4_N, DAC_D4_P, DAC_D5_N, DAC_D5_P, DAC_D6_N, DAC_D6_P, DAC_D7_N, DAC_D7_P

### Notes on the sheet
- DATA - DAC - Filter
- (near U14) Internal diff terminaison is 80@120ohm
- 400Mhz
- 200Mhz
- 50omh must be very close to pin 1 and 7
- Power
- (near U14) DAC_DCI is the input clock at which the date is sent.
  DAC_FRAME is used with ByteMode. Clock input is 2 time slower than DAC_DCI.
- Control
- (near U14) pin 31, 32, 33 and 36 is CMOS input but slow CLK. (<40Mhz)
- (near U14) DACCCLK vs REFCLK vs DATACLK ?
- Sheet Name
- Project Title
- Global Project
- Size
- Group
- Revision
- Date
- Sheet
- of
- Filename
- Designers
- (in symbol DAC_AD9146BCPZ, part A) DAC; DATA RECEIVER

### Library data of the parts
C70#2 C96 C109 = CAP - 0603: Precision: 10%; Current: *; CreatedBy: Jonathan Bouchard; Power: *
C74#2 C97-C108 C130-C132 = CAP - 0402: Precision: 10%; Current: *; CreatedBy: Jonathan Bouchard; Power: *
U14 = DAC_AD9146BCPZ: DAC - 16BIT SRL HIGH SPEED - QFN-48; Voltage: 3.13 V ~ 3.47 V / 1.71 V ~ 1.89 V; Mfg: Analog Devices Inc.; Current: *; Power: *; Mfg Part Number: AD9146BCPZ; HelpURL: http://www.analog.com/media/en/technical-documentation/data-sheets/AD9146.PDF; CreatedBy: Jonathan Bouchard; Temperature: -40°C ~ 85°C; Value: *; Precision: 16 Bit; Package: QFN-48; Supplier 1: Digikey; Supplier Part Number 1: AD9146BCPZ-ND
U15 = OPAMP_AD8056ARMZ: OPAMP - VFB 300MHZ - 8MSOP; Voltage: 8 V ~ 12 V, ±4 V ~ 6 V; Current: 60mA; Mfg: Analog Devices; Power: *; Mfg Part Number: AD8056ARMZ; HelpURL: http://www.analog.com/media/en/technical-documentation/data-sheets/AD8055_8056.pdf; CreatedBy: Jonathan Bouchard; Temperature: -40°C ~ 125°C; Value: *; Precision: *; Package: MSOP-8; Supplier 1: Digikey; Supplier Part Number 1: AD8056ARMZ-REEL7CT-ND
L4-L7 = FER - 0603: Voltage: *; CreatedBy: Jonathan Bouchard; Power: *; Precision: *
R75-R90 = RES - 0603: Current: *; CreatedBy: Jonathan Bouchard
  R80 R81 R87-R89: Value: *